# EAGLE schematic Control_Unit (EAGLE 6.5.0)
Control Unit
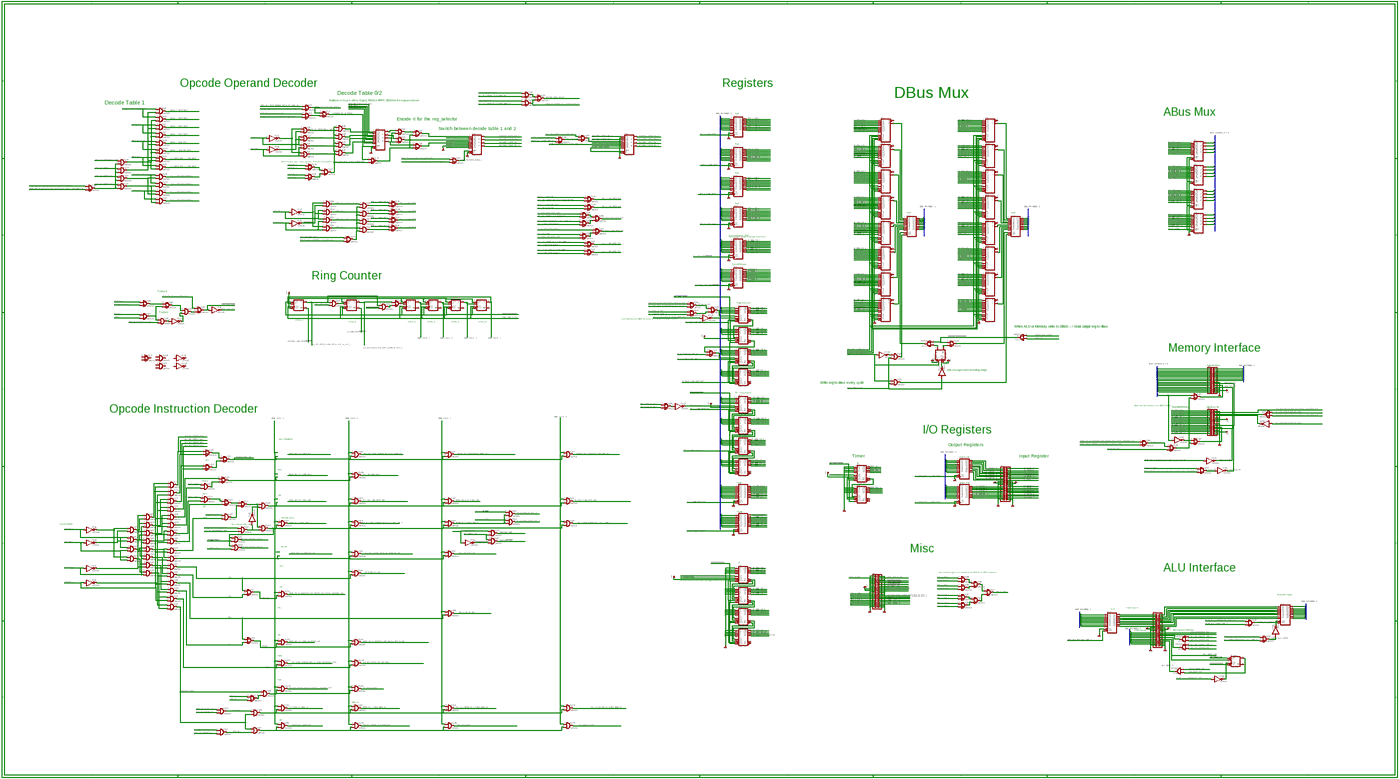
[diagram p0: schematic, sheet 1, overview]
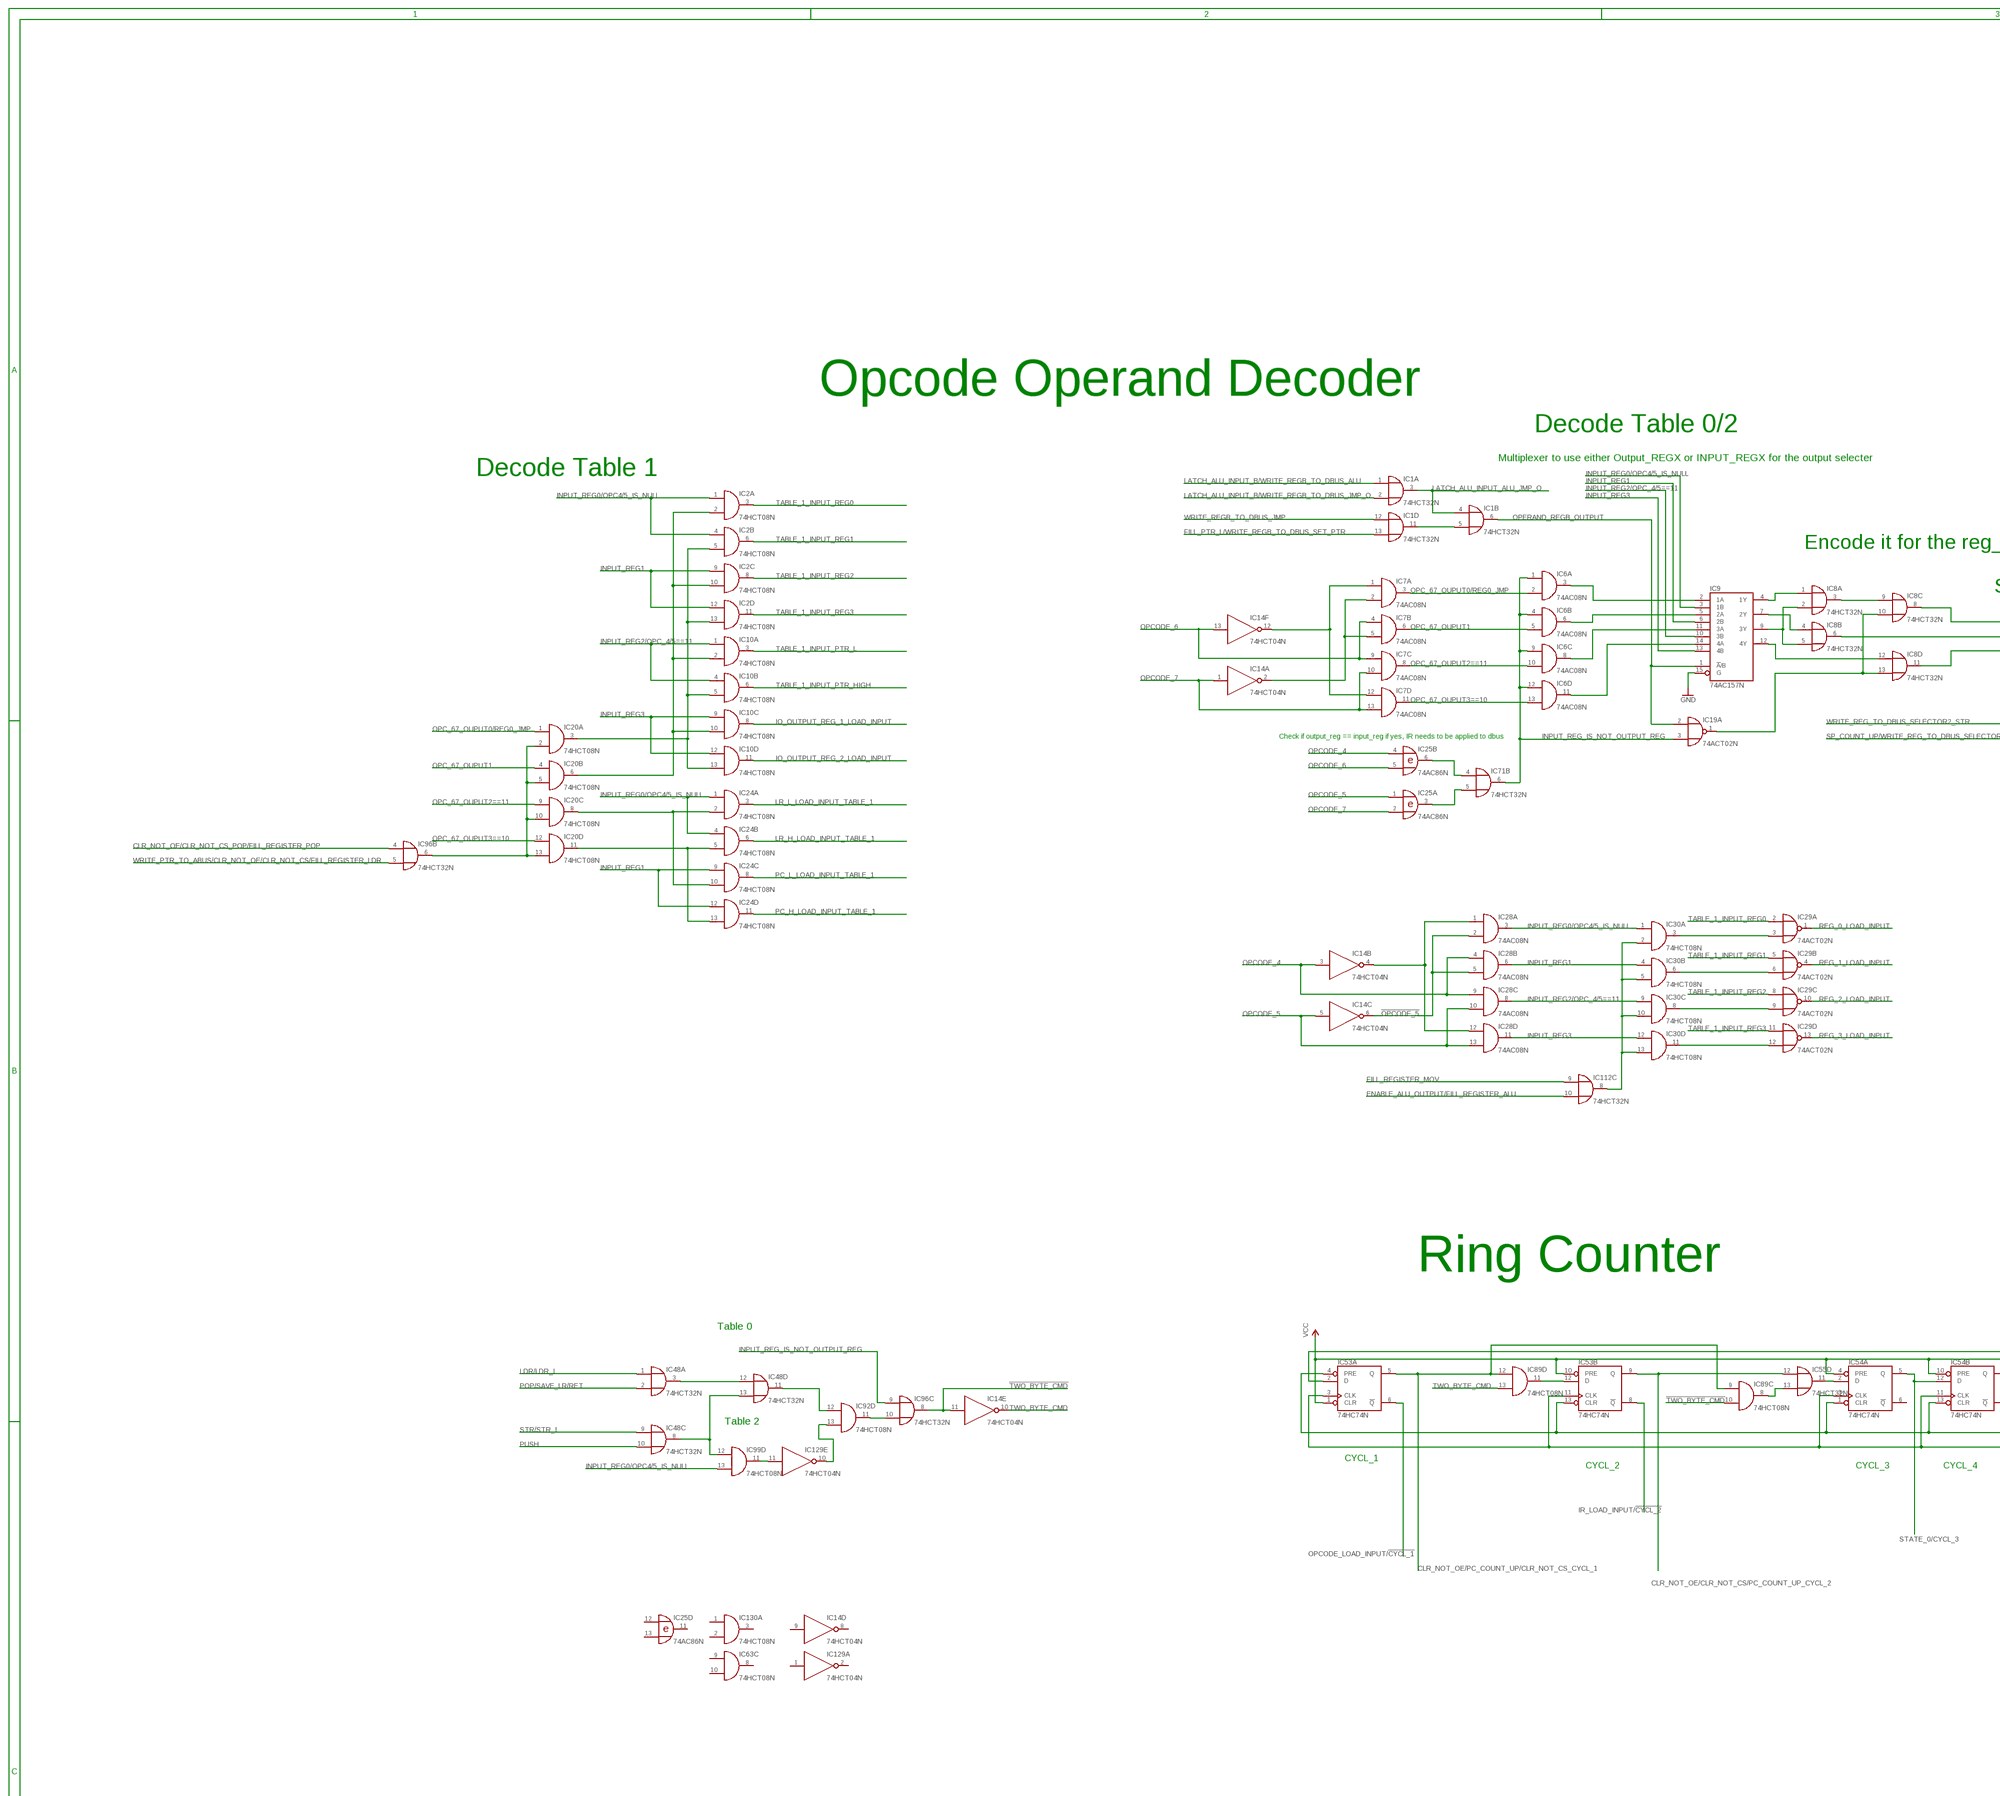
[diagram p1: schematic, sheet 1, part 1 of 8]
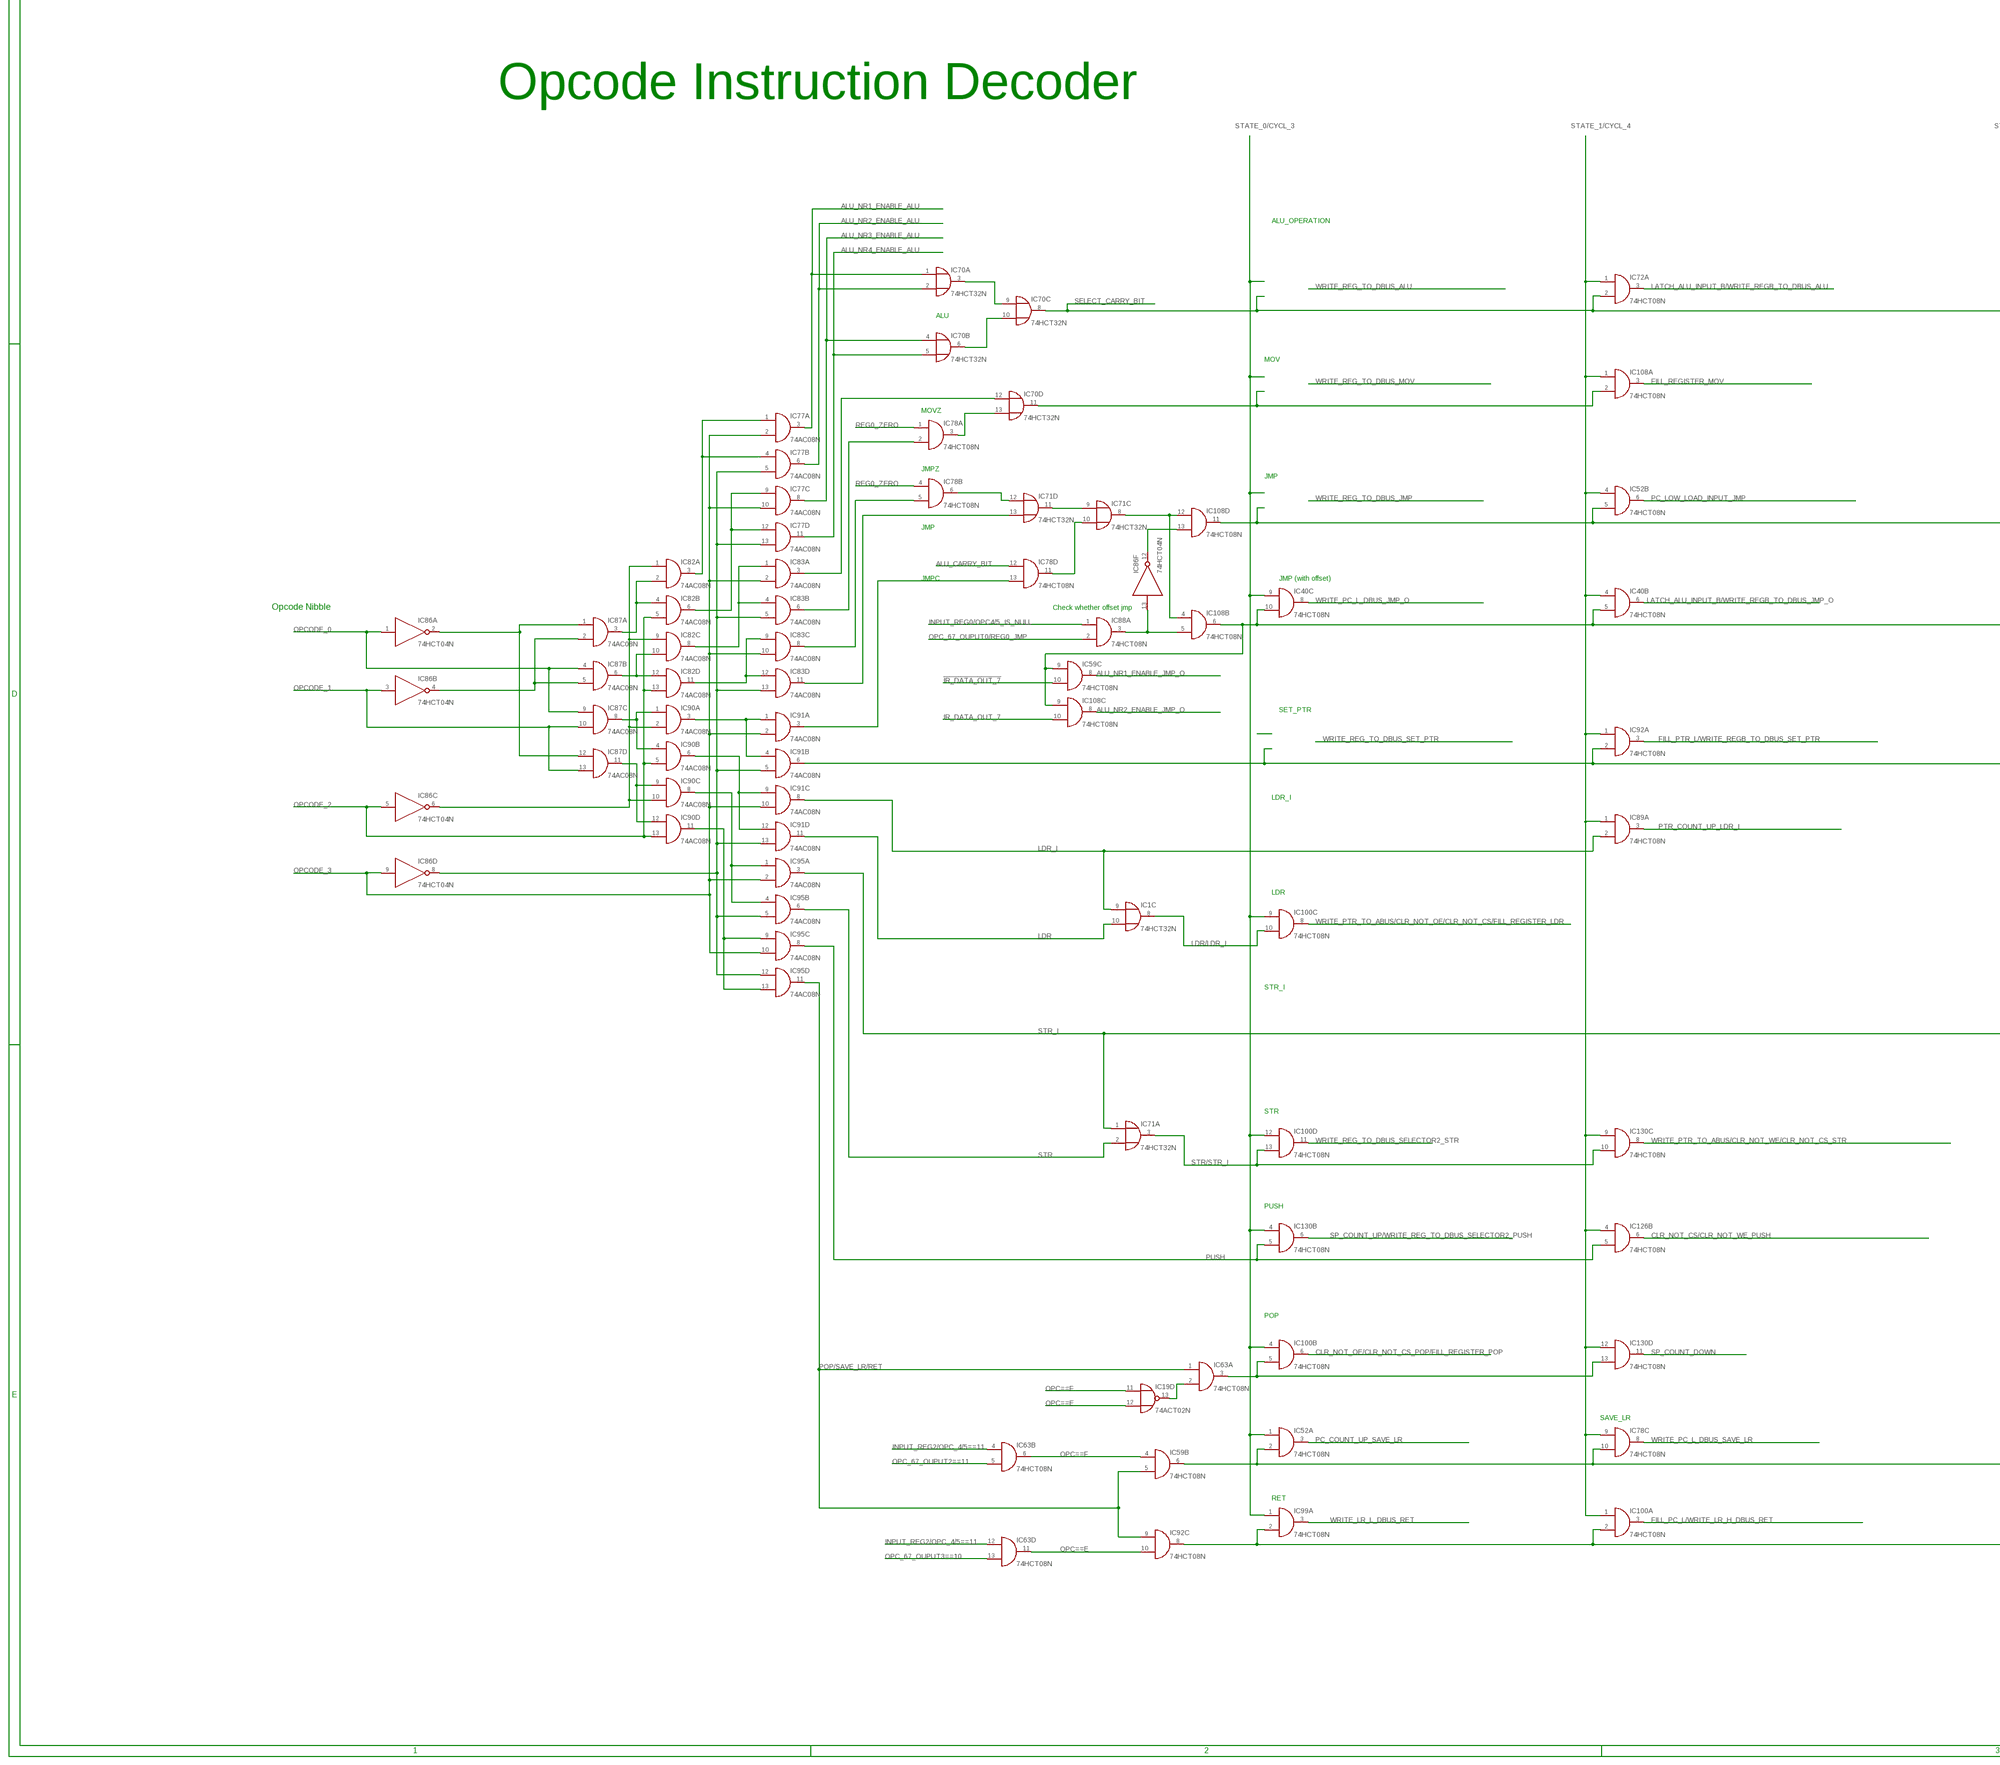
[diagram p2: schematic, sheet 1, part 2 of 8]
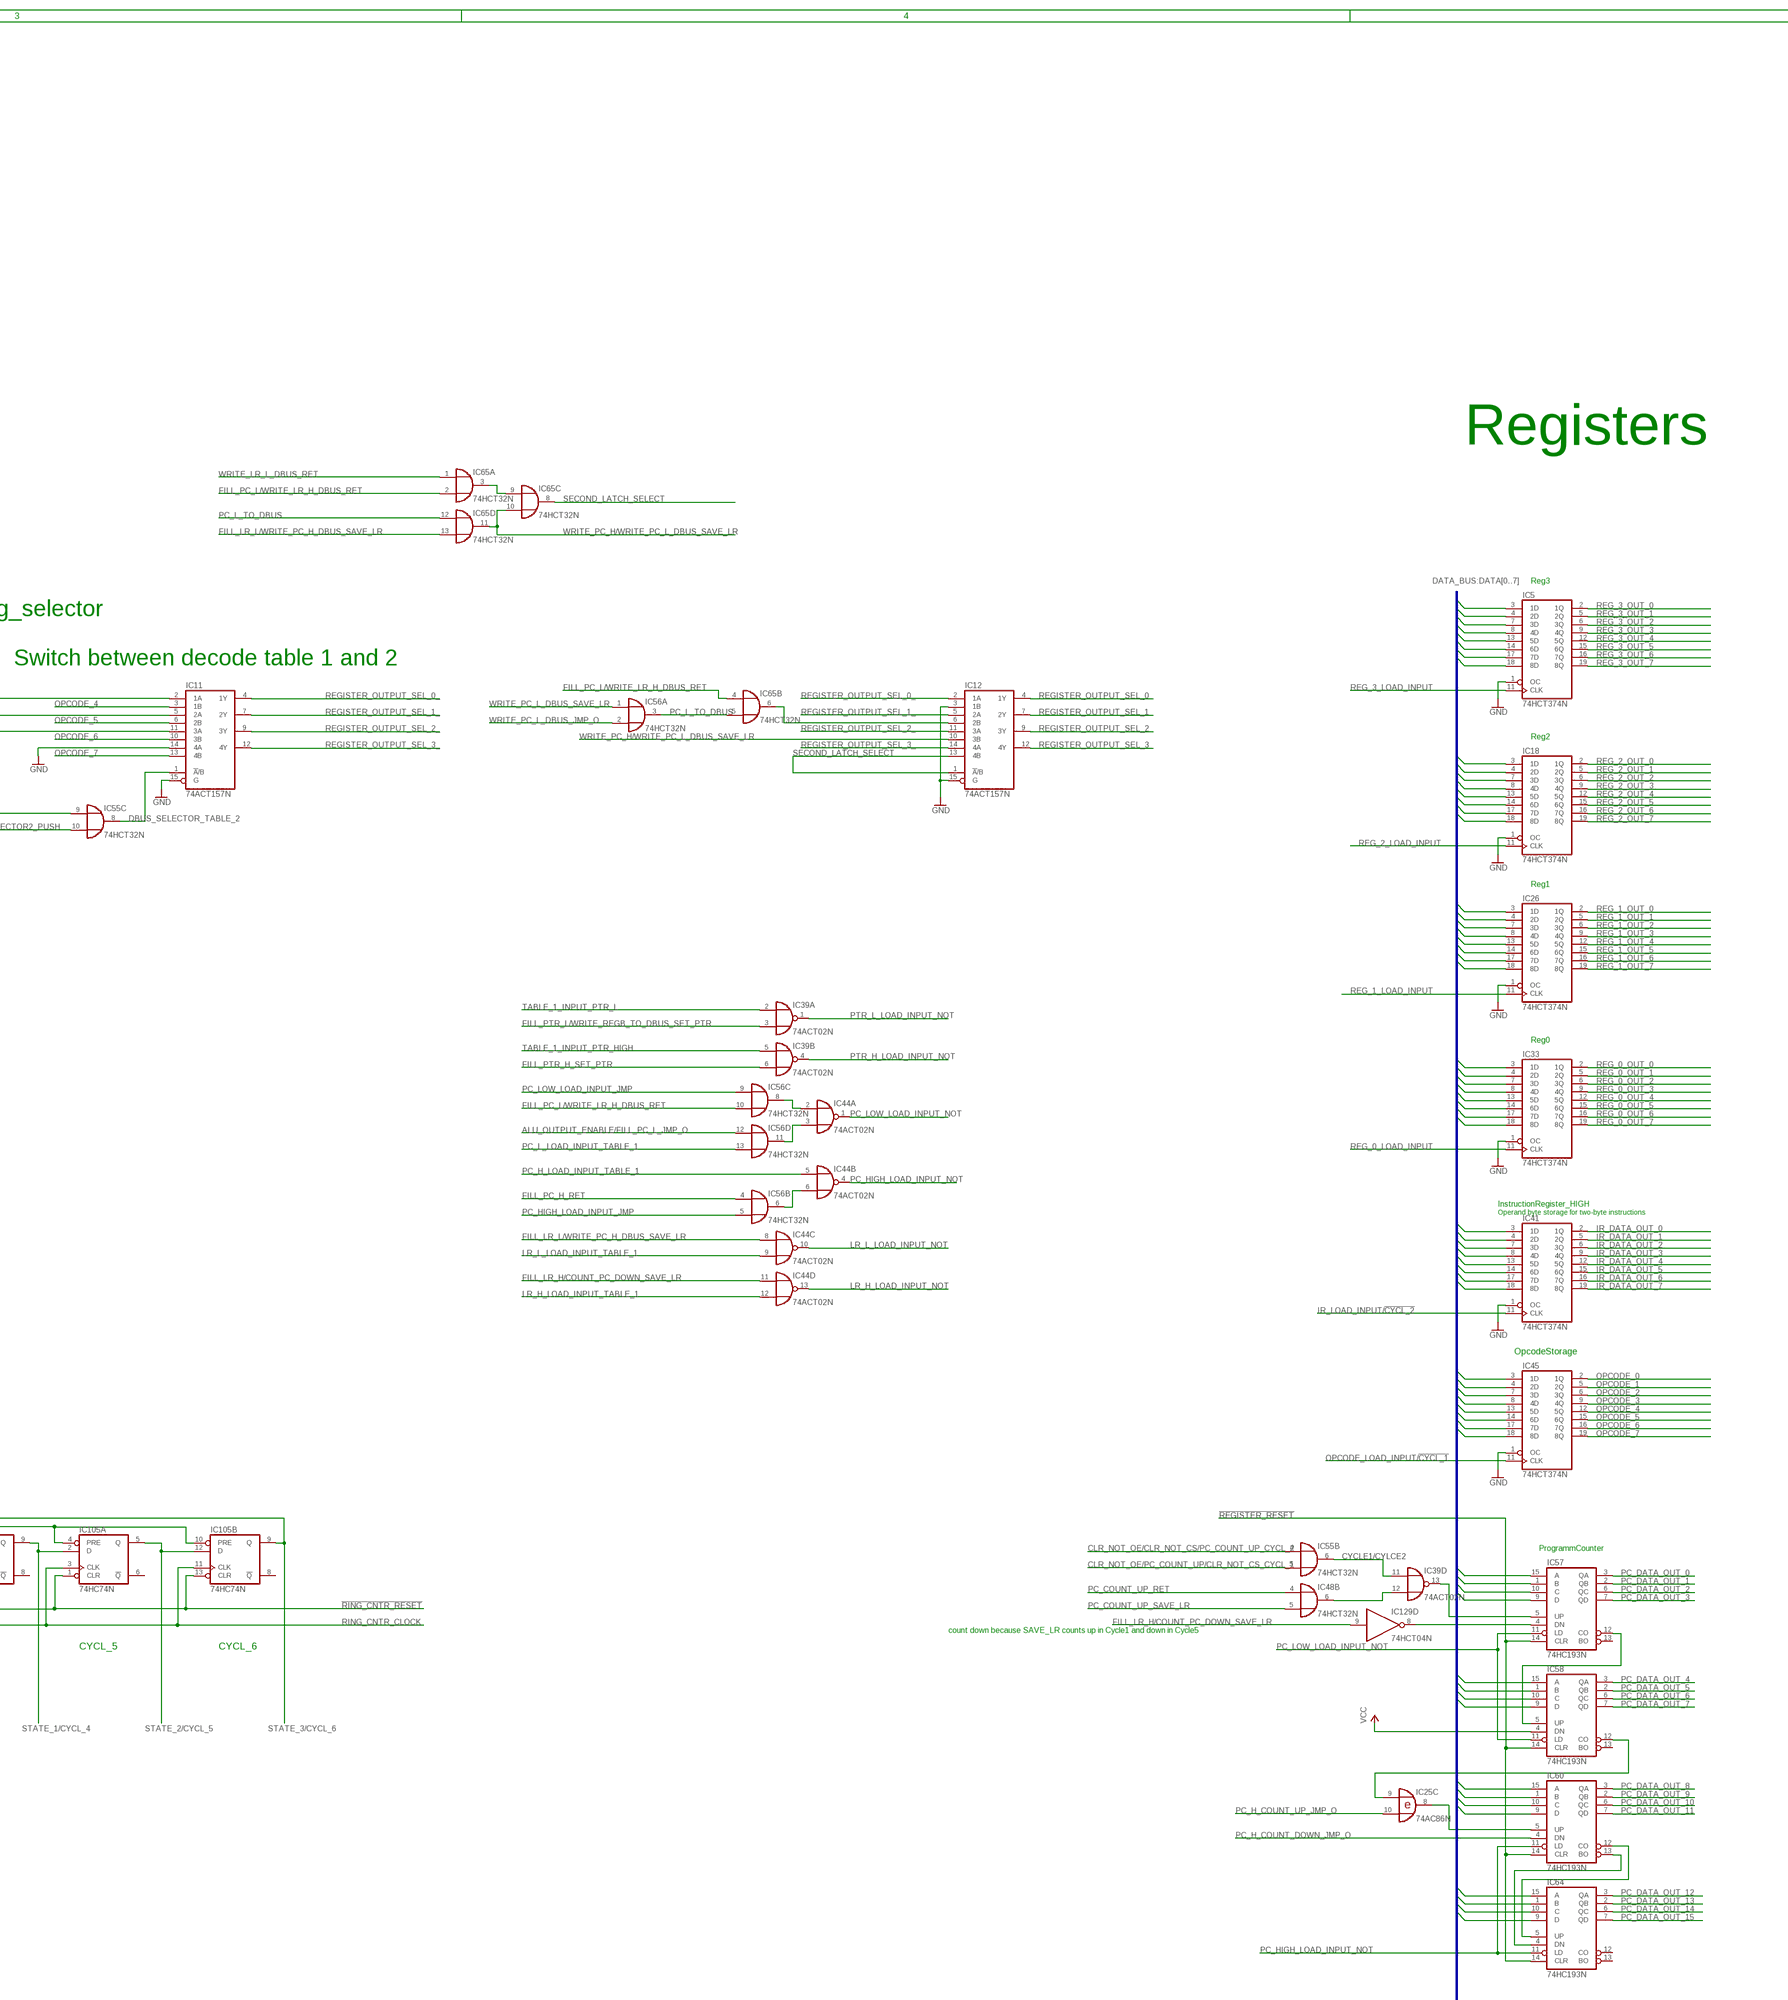
[diagram p3: schematic, sheet 1, part 3 of 8]
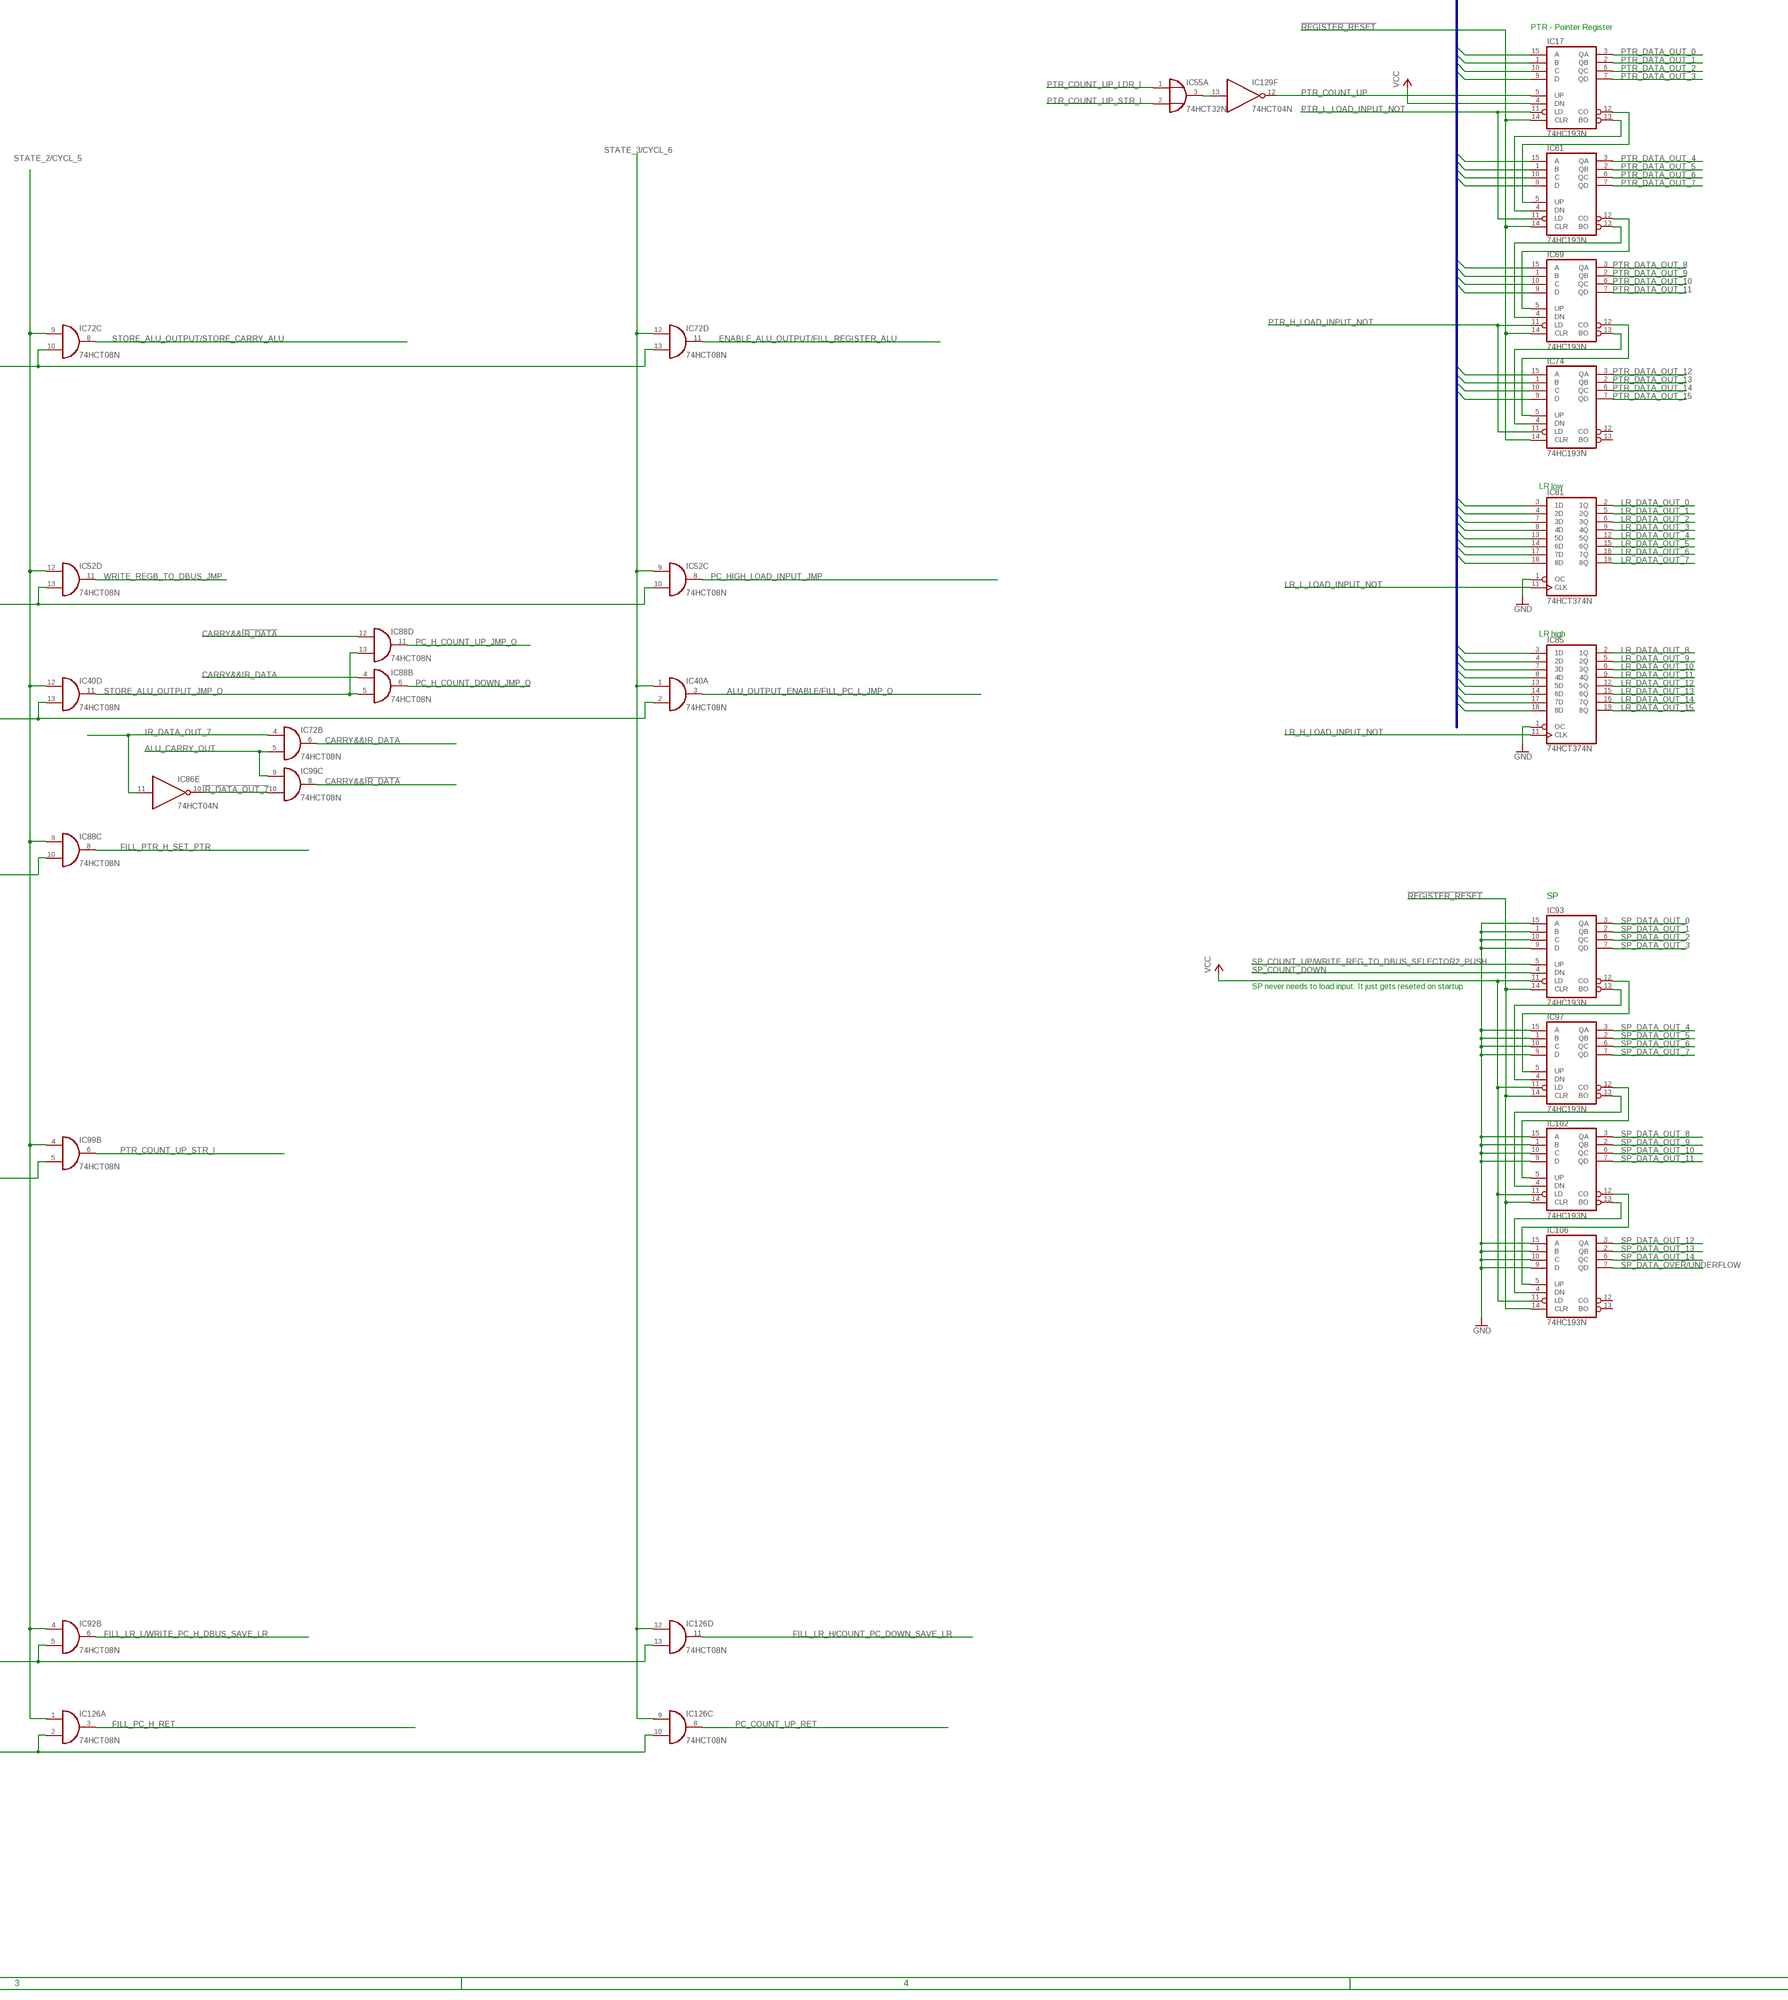
[diagram p4: schematic, sheet 1, part 4 of 8]
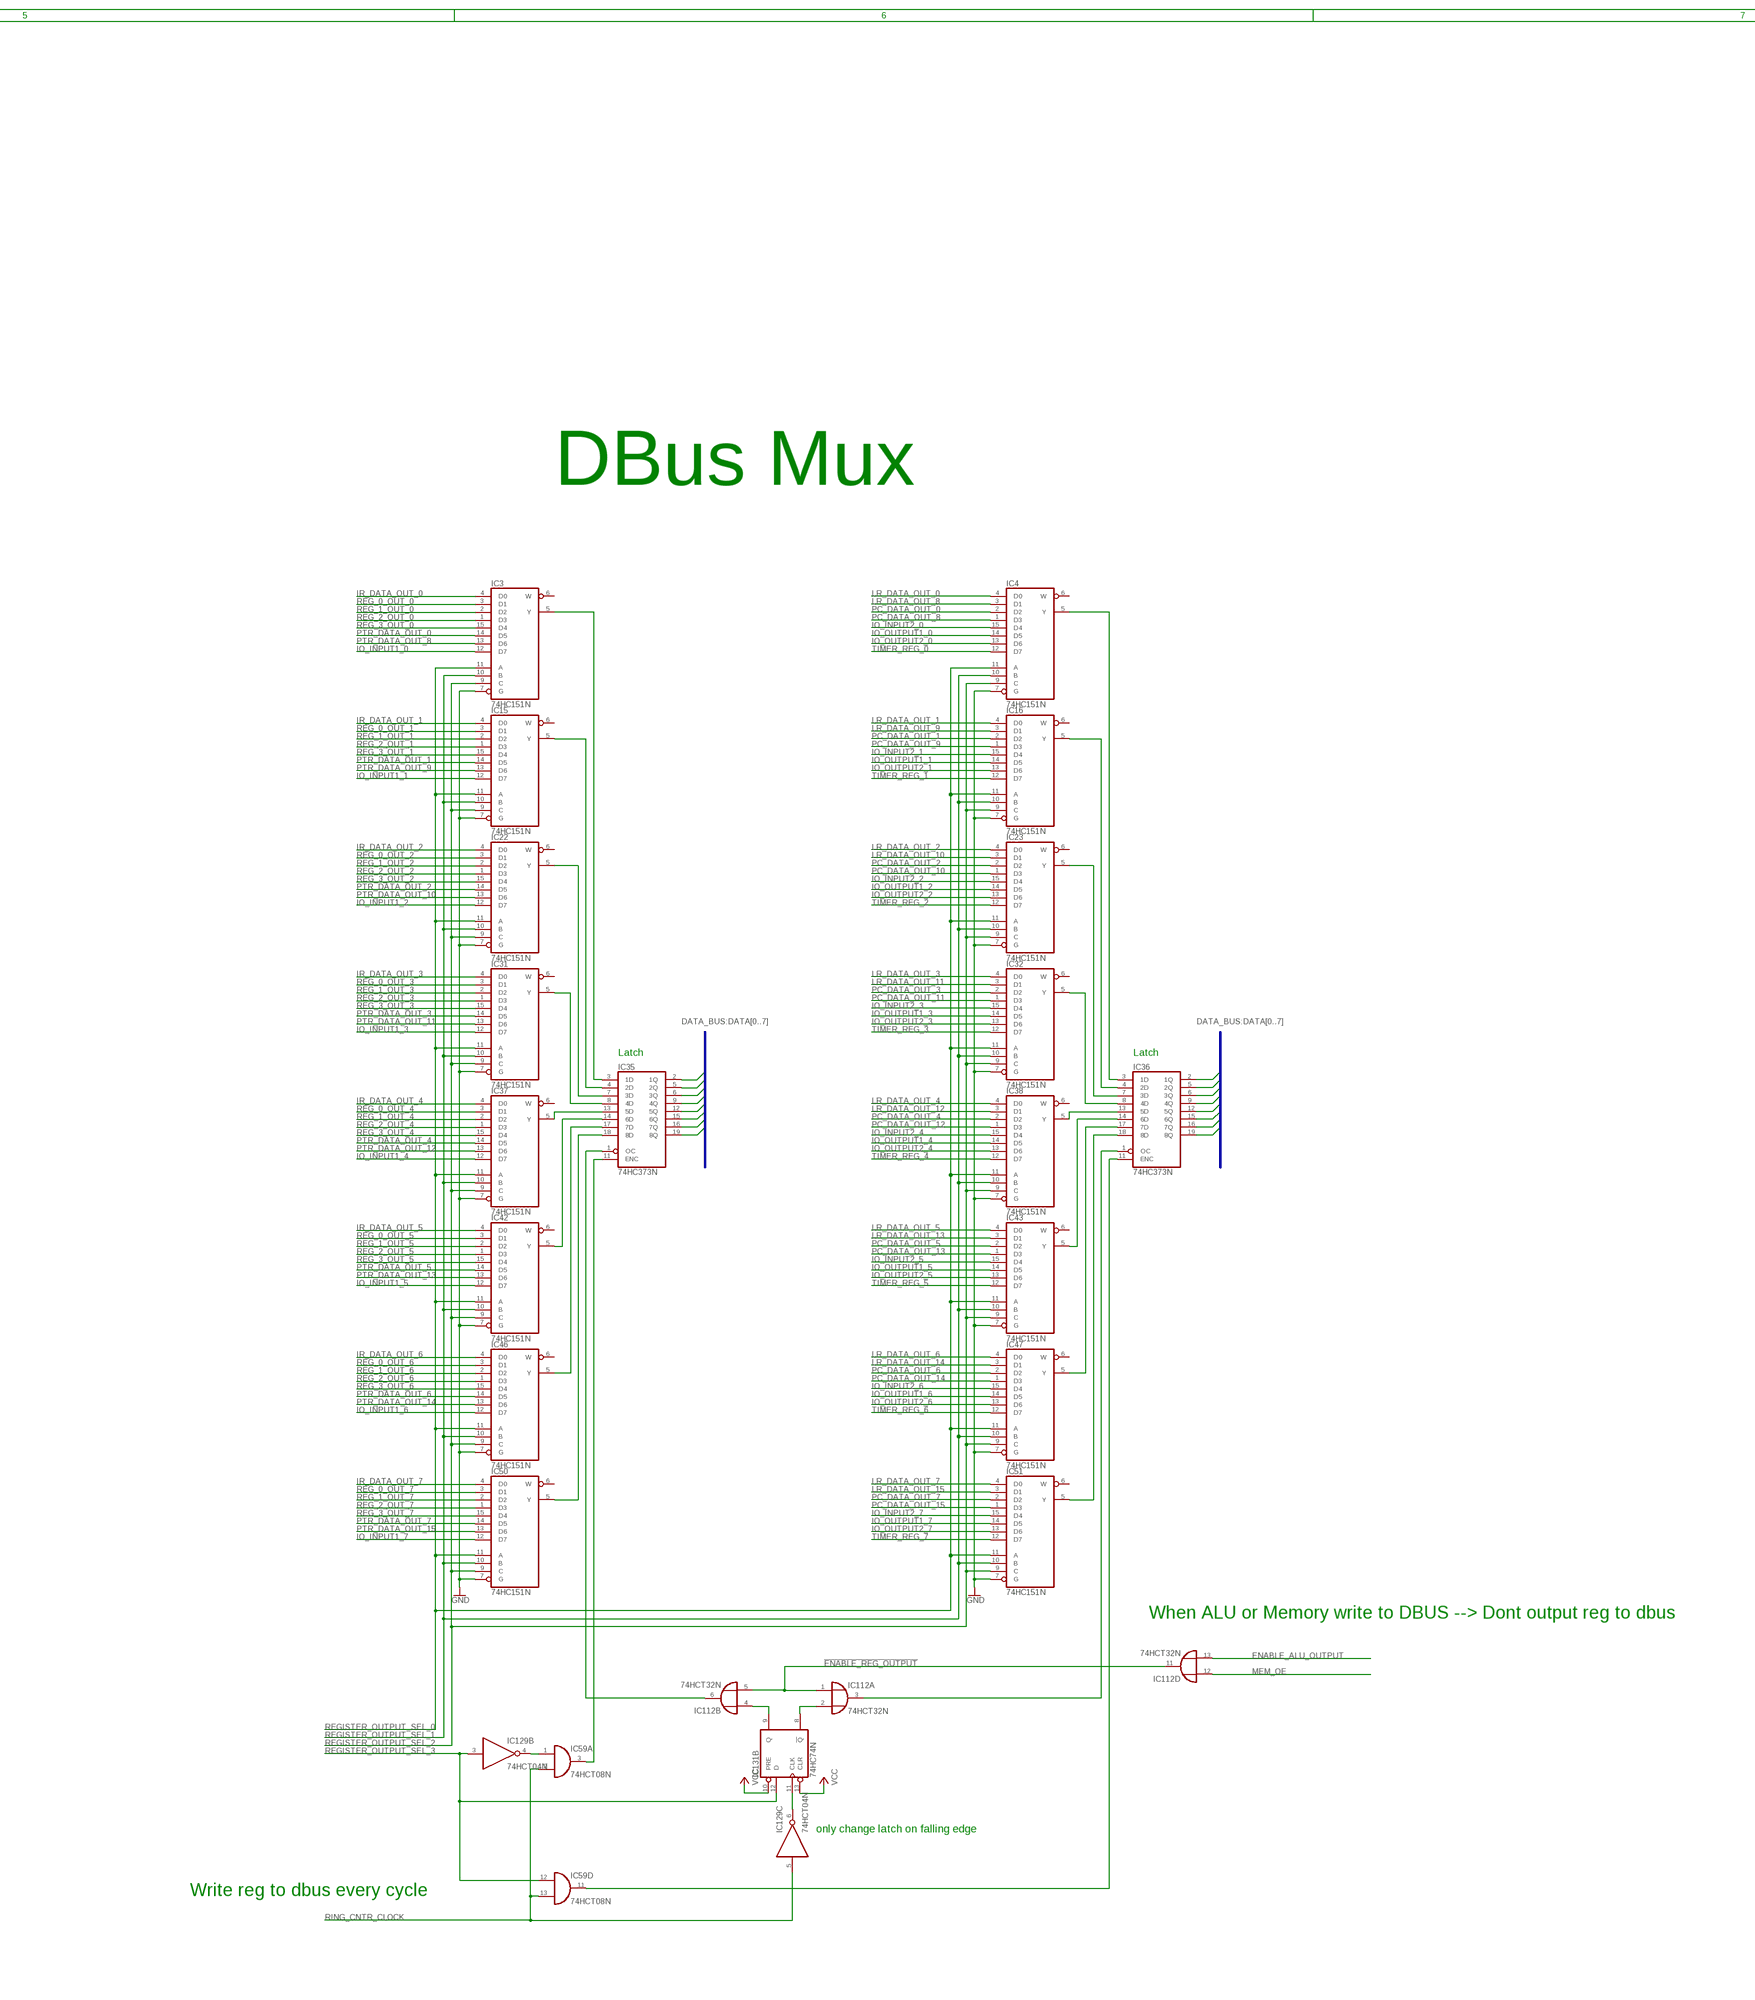
[diagram p5: schematic, sheet 1, part 5 of 8]
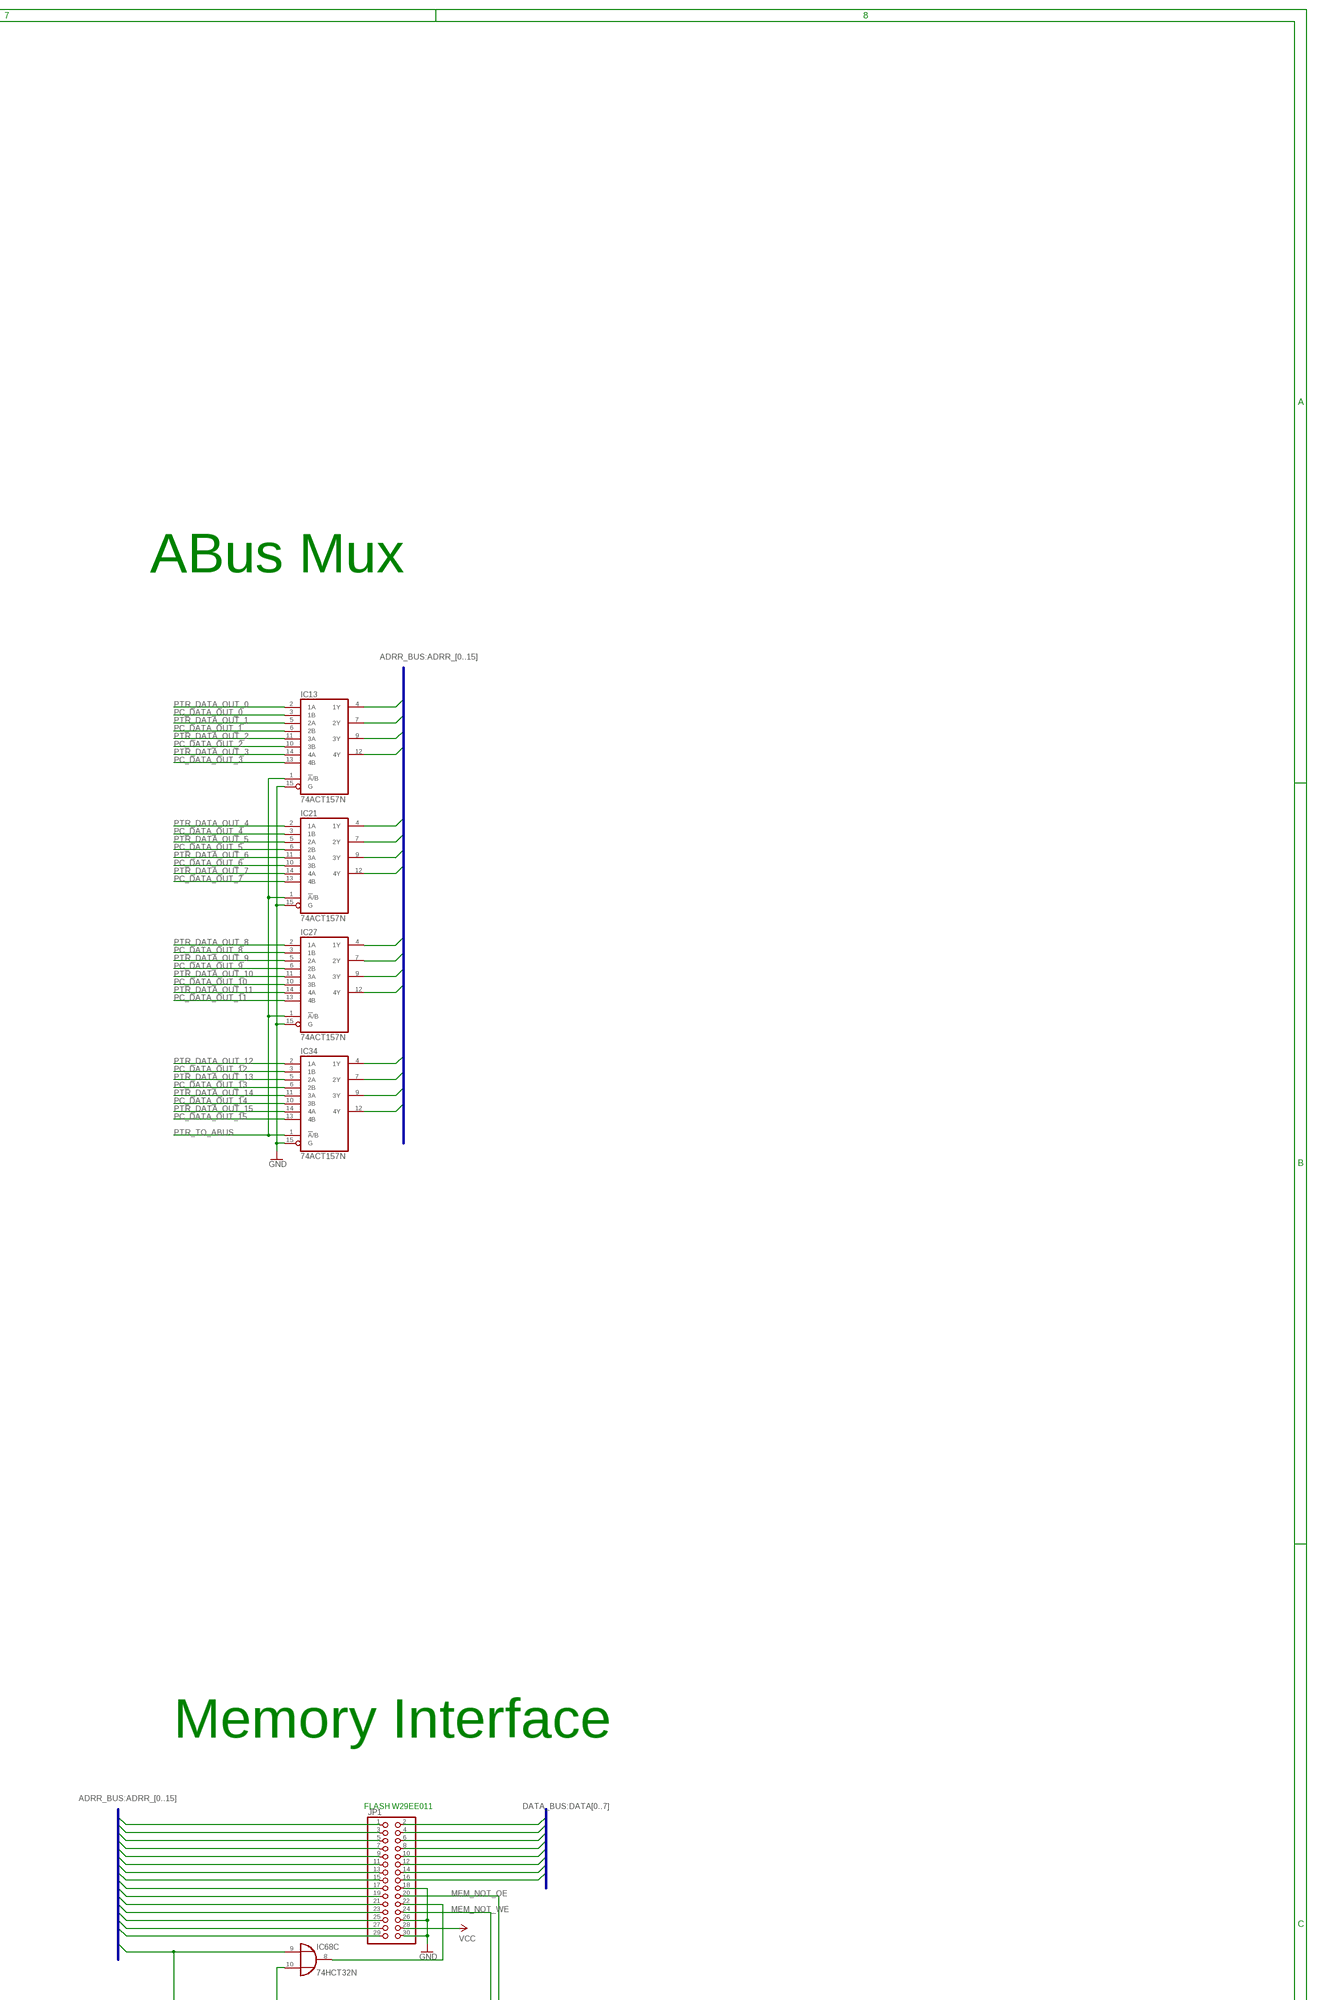
[diagram p6: schematic, sheet 1, part 6 of 8]
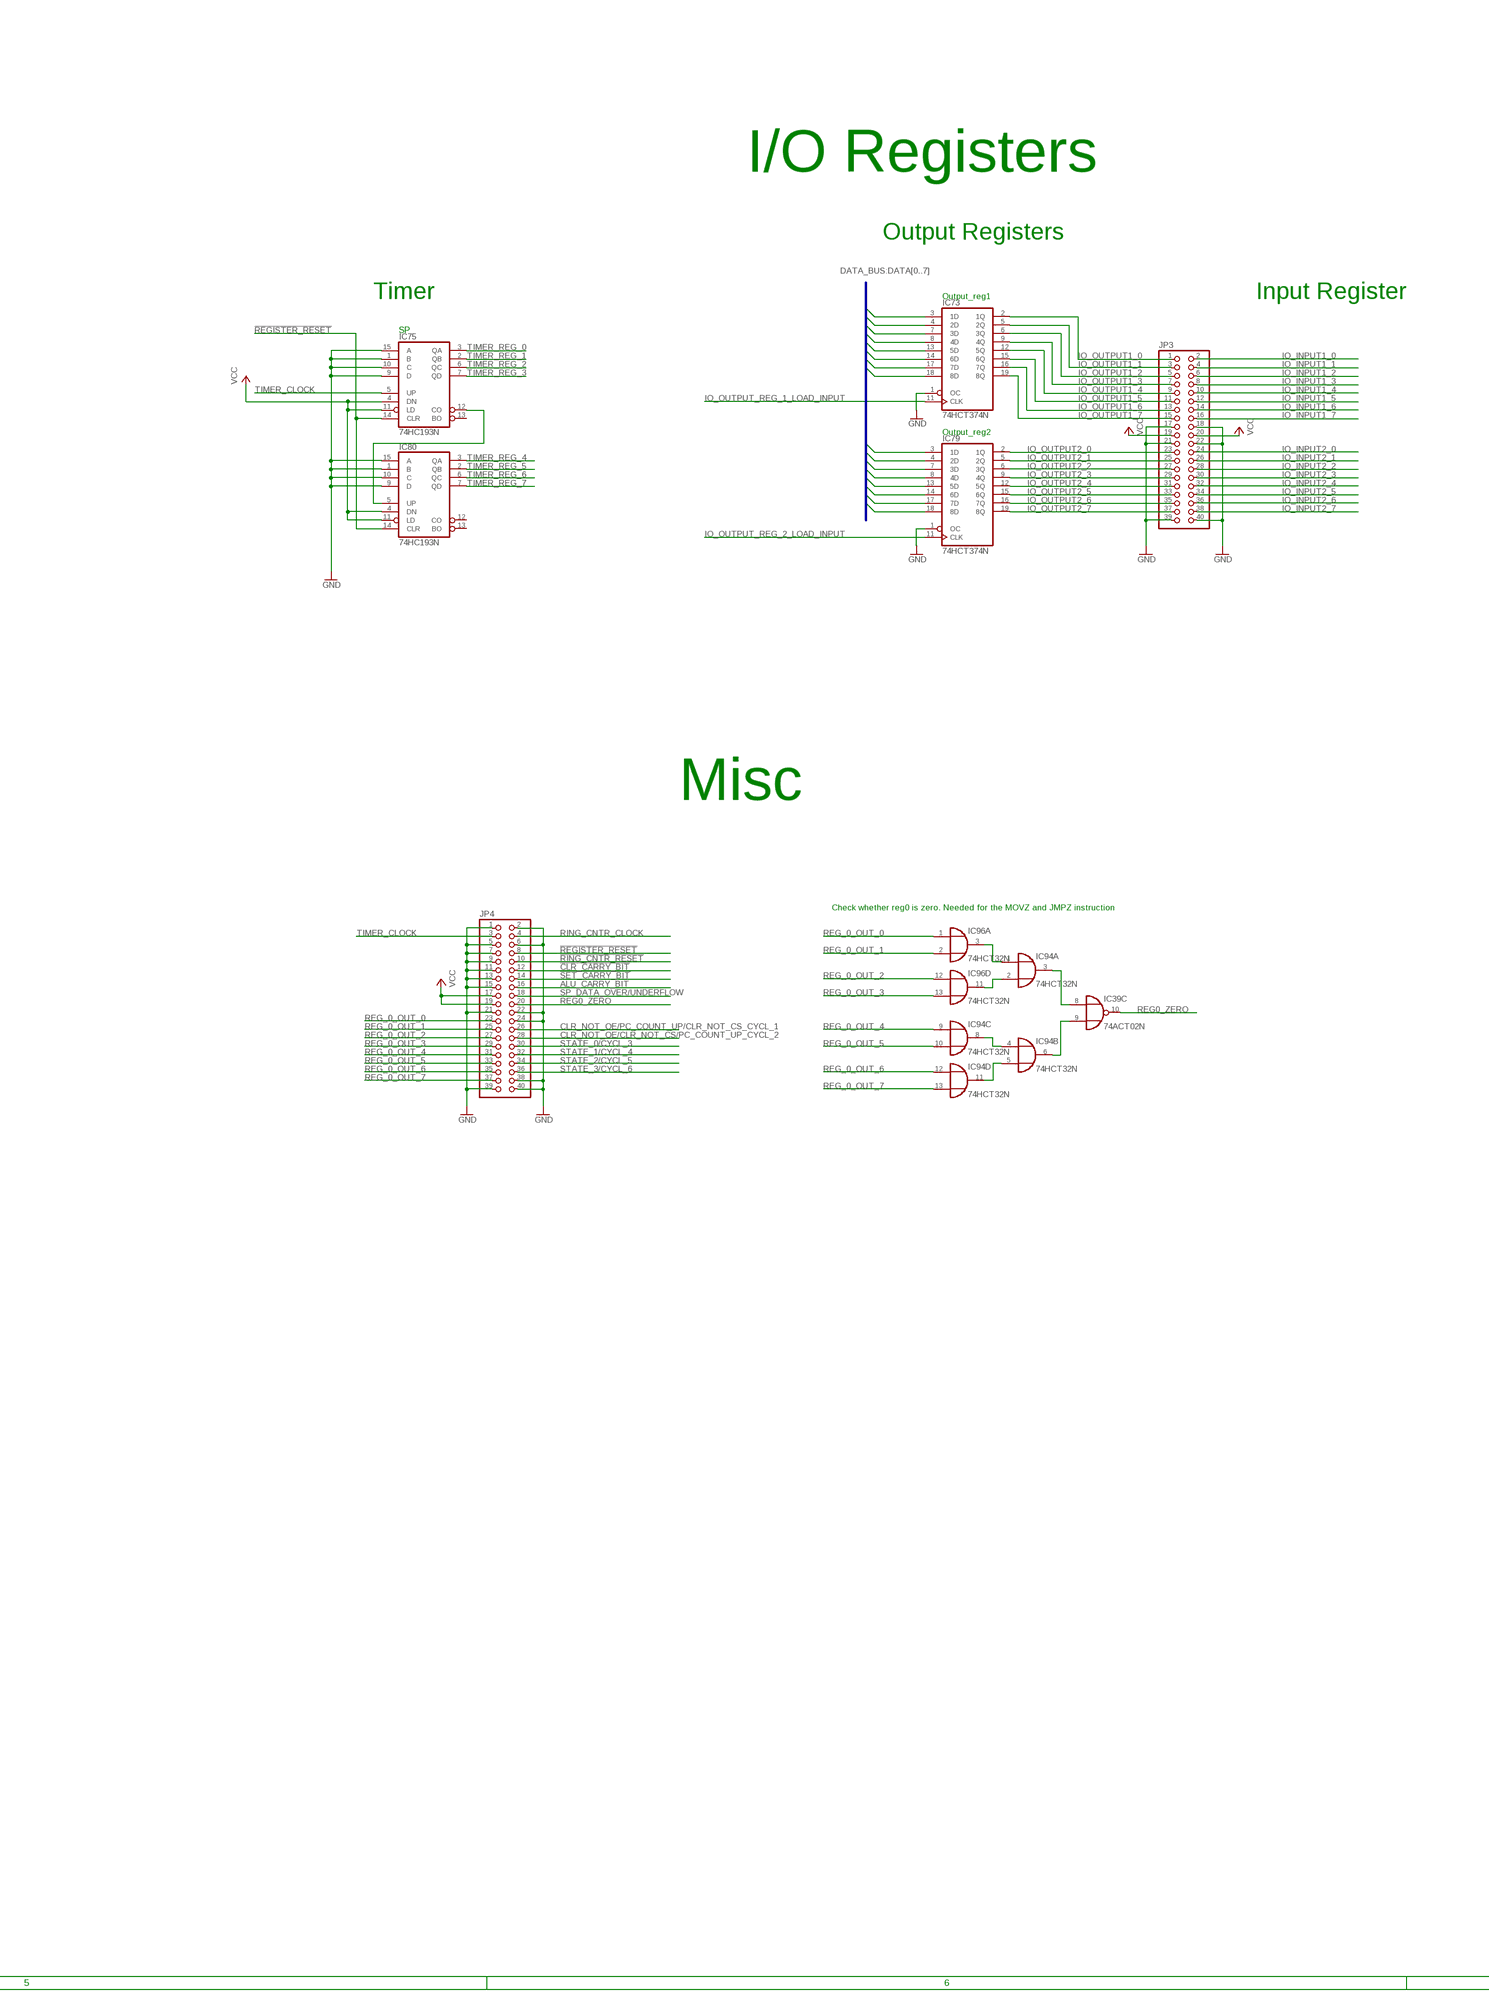
[diagram p7: schematic, sheet 1, part 7 of 8]
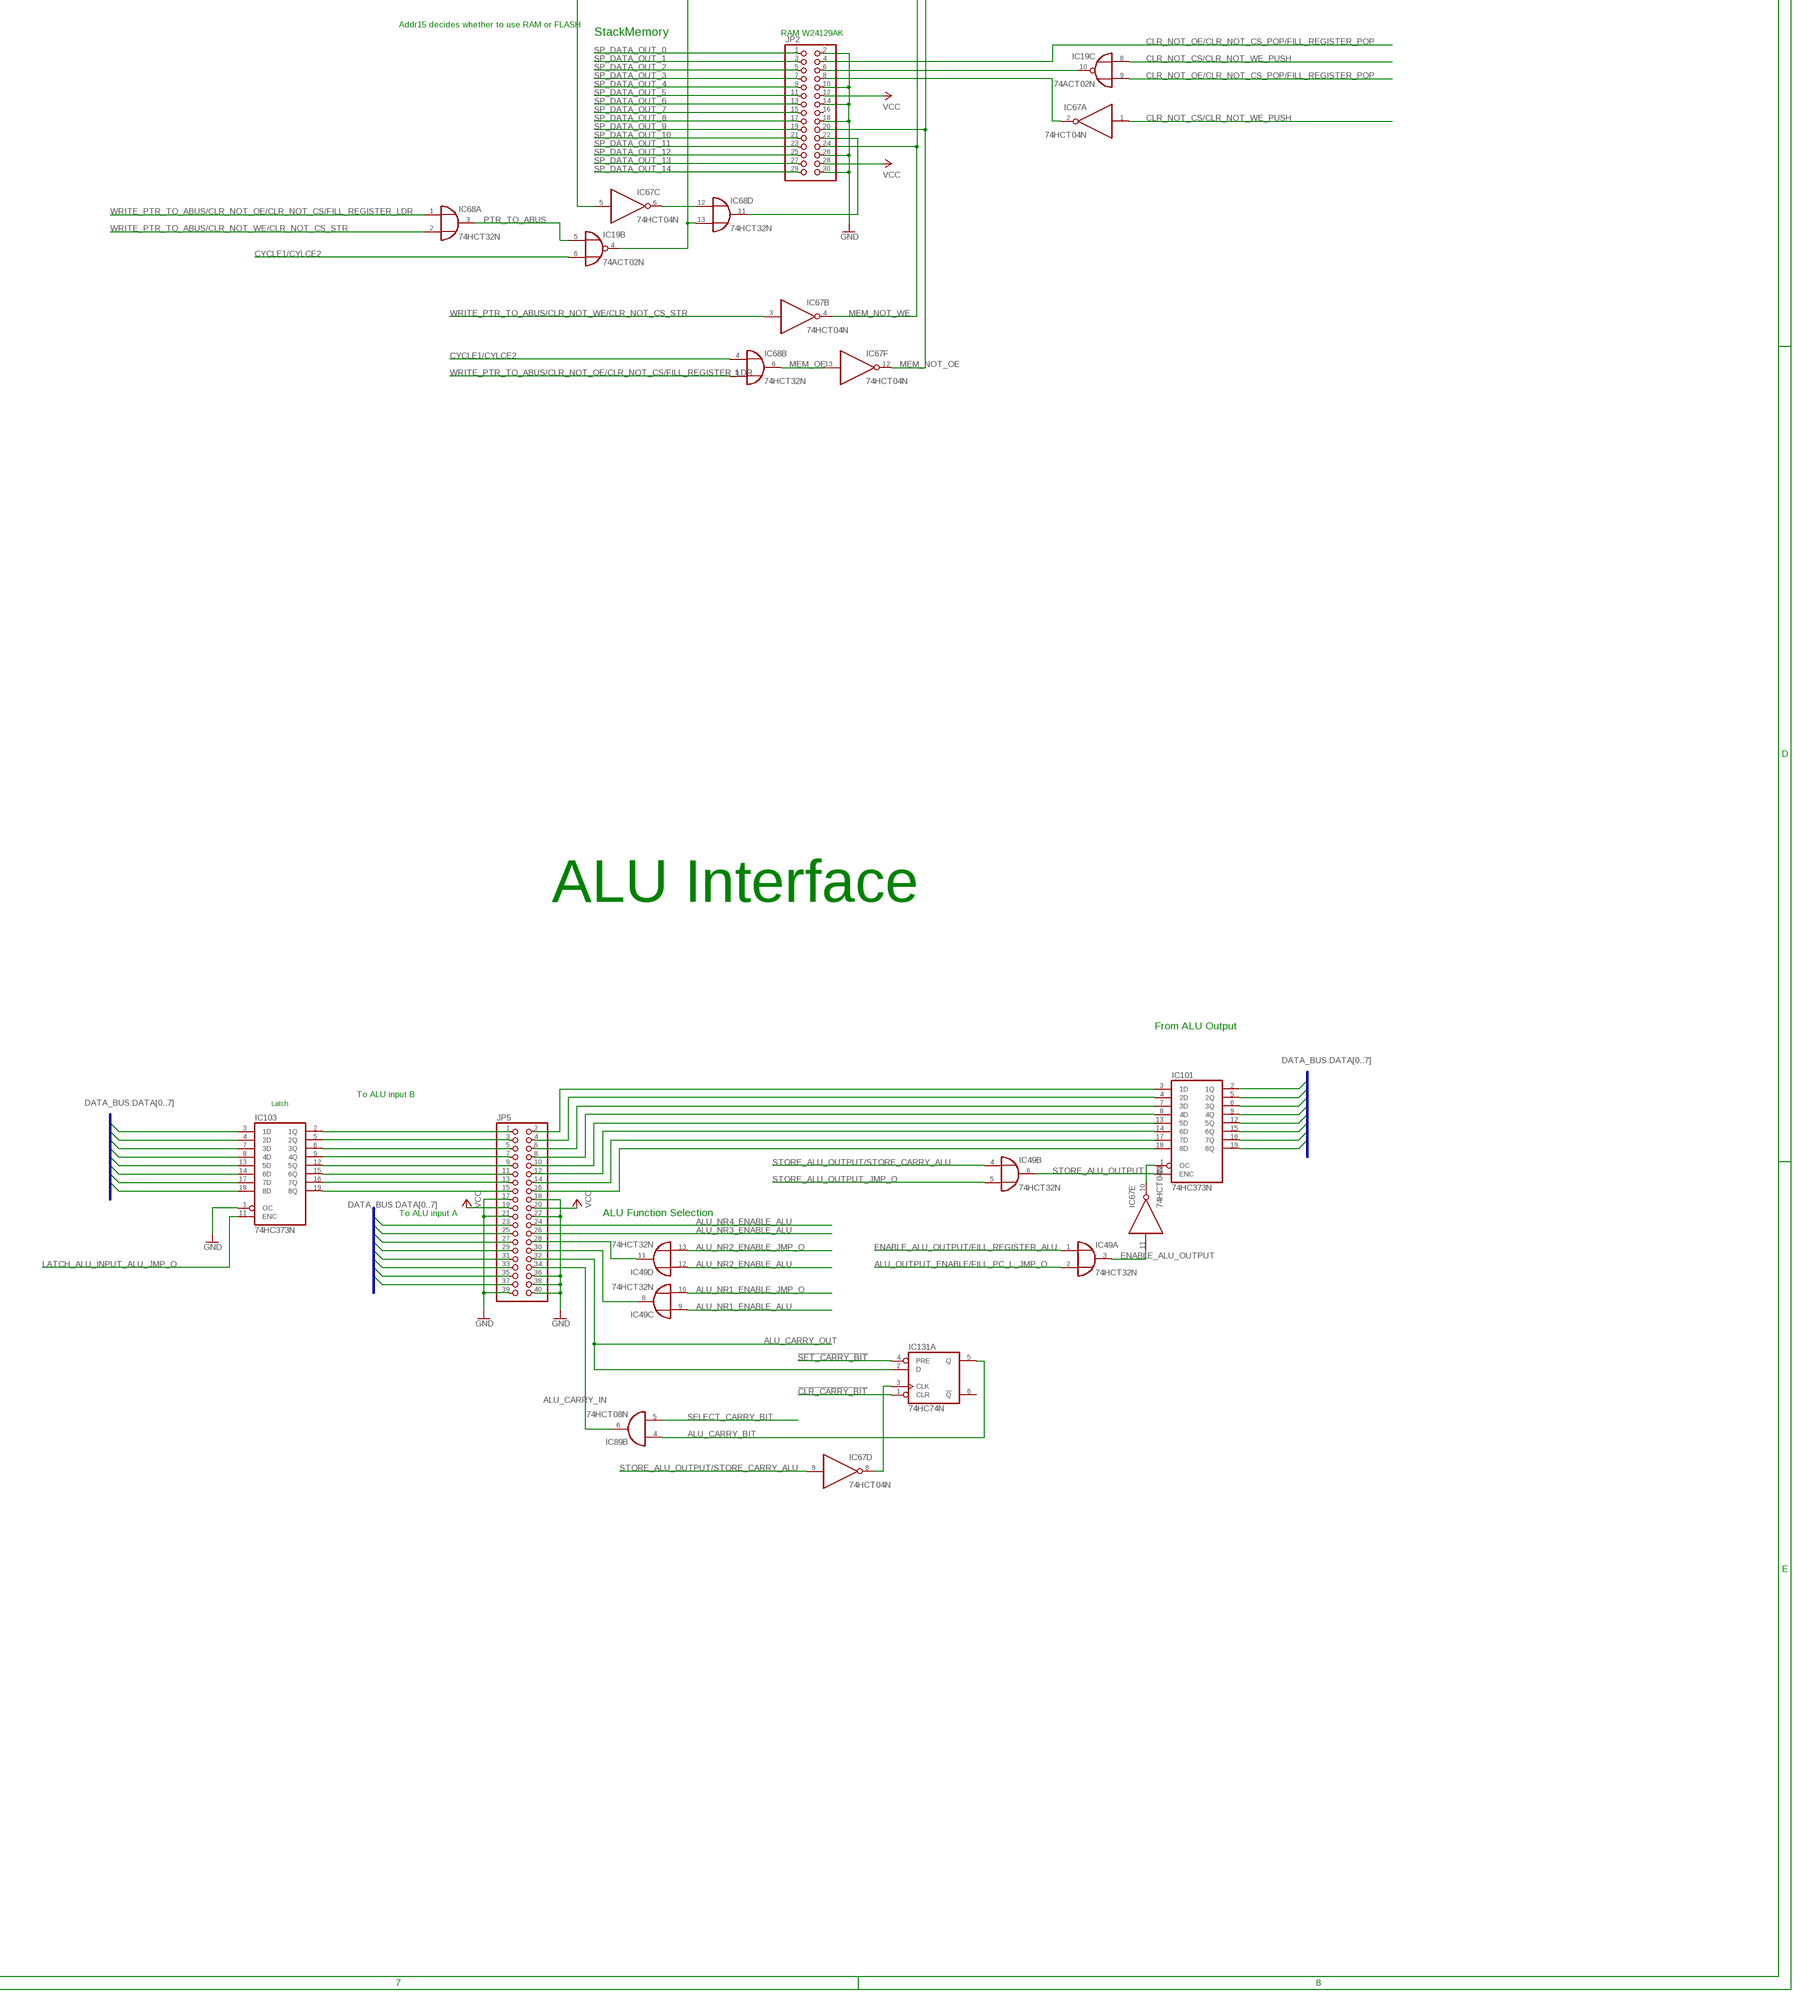
[diagram p8: schematic, sheet 1, part 8 of 8]

## Parts
IC1  74HCT32N  [DIL14]
IC2  74HCT08N  [DIL14]
IC3  74HC151N  [DIL16]
IC4  74HC151N  [DIL16]
IC5  74HCT374N  [DIL20]
IC6  74AC08N  [DIL14]
IC7  74AC08N  [DIL14]
IC8  74HCT32N  [DIL14]
IC9  74AC157N  [DIL16]
IC10  74HCT08N  [DIL14]
IC11  74ACT157N  [DIL16]
IC12  74ACT157N  [DIL16]
IC13  74ACT157N  [DIL16]
IC14  74HCT04N  [DIL14]
IC15  74HC151N  [DIL16]
IC16  74HC151N  [DIL16]
IC17  74HC193N  [DIL16]
IC18  74HCT374N  [DIL20]
IC19  74ACT02N  [DIL14]
IC20  74HCT08N  [DIL14]
IC21  74ACT157N  [DIL16]
IC22  74HC151N  [DIL16]
IC23  74HC151N  [DIL16]
IC24  74HCT08N  [DIL14]
IC25  74AC86N  [DIL14]
IC26  74HCT374N  [DIL20]
IC27  74ACT157N  [DIL16]
IC28  74AC08N  [DIL14]
IC29  74ACT02N  [DIL14]
IC30  74HCT08N  [DIL14]
IC31  74HC151N  [DIL16]
IC32  74HC151N  [DIL16]
IC33  74HCT374N  [DIL20]
IC34  74ACT157N  [DIL16]
IC35  74HC373N  [DIL20]
IC36  74HC373N  [DIL20]
IC37  74HC151N  [DIL16]
IC38  74HC151N  [DIL16]
IC39  74ACT02N  [DIL14]
IC40  74HCT08N  [DIL14]
IC41  74HCT374N  [DIL20]
IC42  74HC151N  [DIL16]
IC43  74HC151N  [DIL16]
IC44  74ACT02N  [DIL14]
IC45  74HCT374N  [DIL20]
IC46  74HC151N  [DIL16]
IC47  74HC151N  [DIL16]
IC48  74HCT32N  [DIL14]
IC49  74HCT32N  [DIL14]
IC50  74HC151N  [DIL16]
IC51  74HC151N  [DIL16]
IC52  74HCT08N  [DIL14]
IC53  74HC74N  [DIL14]
IC54  74HC74N  [DIL14]
IC55  74HCT32N  [DIL14]
IC56  74HCT32N  [DIL14]
IC57  74HC193N  [DIL16]
IC58  74HC193N  [DIL16]
IC59  74HCT08N  [DIL14]
IC60  74HC193N  [DIL16]
IC61  74HC193N  [DIL16]
IC63  74HCT08N  [DIL14]
IC64  74HC193N  [DIL16]
IC65  74HCT32N  [DIL14]
IC67  74HCT04N  [DIL14]
IC68  74HCT32N  [DIL14]
IC69  74HC193N  [DIL16]
IC70  74HCT32N  [DIL14]
IC71  74HCT32N  [DIL14]
IC72  74HCT08N  [DIL14]
IC73  74HCT374N  [DIL20]
IC74  74HC193N  [DIL16]
IC75  74HC193N  [DIL16]
IC77  74AC08N  [DIL14]
IC78  74HCT08N  [DIL14]
IC79  74HCT374N  [DIL20]
IC80  74HC193N  [DIL16]
IC81  74HCT374N  [DIL20]
IC82  74AC08N  [DIL14]
IC83  74AC08N  [DIL14]
IC85  74HCT374N  [DIL20]
IC86  74HCT04N  [DIL14]
IC87  74AC08N  [DIL14]
IC88  74HCT08N  [DIL14]
IC89  74HCT08N  [DIL14]
IC90  74AC08N  [DIL14]
IC91  74AC08N  [DIL14]
IC92  74HCT08N  [DIL14]
IC93  74HC193N  [DIL16]
IC94  74HCT32N  [DIL14]
IC95  74AC08N  [DIL14]
IC96  74HCT32N  [DIL14]
IC97  74HC193N  [DIL16]
IC99  74HCT08N  [DIL14]
IC100  74HCT08N  [DIL14]
IC101  74HC373N  [DIL20]
IC102  74HC193N  [DIL16]
IC103  74HC373N  [DIL20]
IC105  74HC74N  [DIL14]
IC106  74HC193N  [DIL16]
IC108  74HCT08N  [DIL14]
IC112  74HCT32N  [DIL14]
IC126  74HCT08N  [DIL14]
IC129  74HCT04N  [DIL14]
IC130  74HCT08N  [DIL14]
IC131  74HC74N  [DIL14]
JP1  PINHD-2X15  [2X15]
JP2  PINHD-2X15  [2X15]
JP3  PINHD-2X20  [2X20]
JP4  PINHD-2X20  [2X20]
JP5  PINHD-2X20  [2X20]

## Nets
!CLR_CARRY_BIT: IC131.1(A:CLR) JP4.12
!ENABLE_REG_OUTPUT: IC112.1(A:I0) IC112.5(B:I1) IC112.11(D:O)
!IR_DATA_OUT_7: IC59.10(C:I1) IC86.10(E:O) IC99.10(C:I1)
!OPCODE_5: IC14.6(C:O) IC28.2(A:I1) IC28.5(B:I1)
!REGISTER_RESET: IC17.14(CLR) IC57.14(CLR) IC58.14(CLR) IC60.14(CLR) IC61.14(CLR) IC64.14(CLR) IC69.14(CLR) IC74.14(CLR) IC75.14(CLR) IC80.14(CLR) IC93.14(CLR) IC97.14(CLR) IC102.14(CLR) IC106.14(CLR) JP4.8
!RING_CNTR_RESET: IC53.4(A:PRE) IC53.13(B:CLR) IC54.1(A:CLR) IC54.13(B:CLR) IC105.1(A:CLR) IC105.13(B:CLR) JP4.10
!SET_CARRY_BIT: IC131.4(A:PRE) JP4.14
!TWO_BYTE_CMD: IC14.11(E:I) IC89.10(C:I1) IC96.8(C:O)
ADRR_0: IC13.4(1Y) JP1.1
ADRR_1: IC13.7(2Y) JP1.3
ADRR_2: IC13.9(3Y) JP1.5
ADRR_3: IC13.12(4Y) JP1.7
ADRR_4: IC21.4(1Y) JP1.9
ADRR_5: IC21.7(2Y) JP1.11
ADRR_6: IC21.9(3Y) JP1.13
ADRR_7: IC21.12(4Y) JP1.15
ADRR_8: IC27.4(1Y) JP1.17
ADRR_9: IC27.7(2Y) JP1.19
ADRR_10: IC27.9(3Y) JP1.21
ADRR_11: IC27.12(4Y) JP1.23
ADRR_12: IC34.4(1Y) JP1.25
ADRR_13: IC34.7(2Y) JP1.27
ADRR_14: IC34.9(3Y) JP1.29
ADRR_15: IC34.12(4Y) IC67.5(C:I) IC68.9(C:I0)
ALU_CARRY_BIT: IC78.12(D:I0) IC89.4(B:I0) IC131.5(A:Q) JP4.16
ALU_CARRY_IN: IC89.6(B:O) JP5.34
ALU_CARRY_OUT: IC72.5(B:I1) IC99.9(C:I0) IC131.2(A:D) JP5.32
ALU_NR1_ENABLE_ALU: IC49.9(C:I0) IC70.1(A:I0) IC77.3(A:O)
ALU_NR1_ENABLE_JMP_O: IC49.10(C:I1) IC59.8(C:O)
ALU_NR2_ENABLE_ALU: IC49.12(D:I0) IC70.2(A:I1) IC77.6(B:O)
ALU_NR2_ENABLE_JMP_O: IC49.13(D:I1) IC108.8(C:O)
ALU_NR3_ENABLE_ALU: IC70.4(B:I0) IC77.8(C:O) JP5.26
ALU_NR4_ENABLE_ALU: IC70.5(B:I1) IC77.11(D:O) JP5.24
ALU_OUTPUT_ENABLE/FILL_PC_L_JMP_O: IC40.3(A:O) IC49.2(A:I1) IC56.12(D:I0)
CARRY&&!IR_DATA: IC88.12(D:I0) IC99.8(C:O)
CARRY&&IR_DATA: IC72.6(B:O) IC88.4(B:I0)
CLR_NOT_CS/CLR_NOT_WE_PUSH: IC19.8(C:I0) IC67.1(A:I) IC126.6(B:O)
CLR_NOT_OE/CLR_NOT_CS/PC_COUNT_UP_CYCL_2: IC53.9(B:Q) IC55.4(B:I0) IC55.12(D:I0) JP4.28
CLR_NOT_OE/CLR_NOT_CS_POP/FILL_REGISTER_POP: IC19.9(C:I1) IC96.4(B:I0) IC100.6(B:O) JP2.4
CLR_NOT_OE/PC_COUNT_UP/CLR_NOT_CS_CYCL_1: IC53.5(A:Q) IC55.5(B:I1) IC89.9(C:I0) IC89.12(D:I0) JP4.26
CYCLE1/CYLCE2: IC19.6(B:I1) IC39.11(D:I0) IC55.6(B:O) IC68.4(B:I0)
DATA0: IC5.3(1D) IC17.15(A) IC18.3(1D) IC26.3(1D) IC33.3(1D) IC35.2(1Q) IC36.2(1Q) IC41.3(1D) IC45.3(1D) IC57.15(A) IC60.15(A) IC69.15(A) IC73.3(1D) IC79.3(1D) IC81.3(1D) IC85.3(1D) IC101.2(1Q) IC103.3(1D) JP1.2 JP5.23
DATA1: IC5.4(2D) IC17.1(B) IC18.4(2D) IC26.4(2D) IC33.4(2D) IC35.5(2Q) IC36.5(2Q) IC41.4(2D) IC45.4(2D) IC57.1(B) IC60.1(B) IC69.1(B) IC73.4(2D) IC79.4(2D) IC81.4(2D) IC85.4(2D) IC101.5(2Q) IC103.4(2D) JP1.4 JP5.25
DATA2: IC5.7(3D) IC17.10(C) IC18.7(3D) IC26.7(3D) IC33.7(3D) IC35.6(3Q) IC36.6(3Q) IC41.7(3D) IC45.7(3D) IC57.10(C) IC60.10(C) IC69.10(C) IC73.7(3D) IC79.7(3D) IC81.7(3D) IC85.7(3D) IC101.6(3Q) IC103.7(3D) JP1.6 JP5.27
DATA3: IC5.8(4D) IC17.9(D) IC18.8(4D) IC26.8(4D) IC33.8(4D) IC35.9(4Q) IC36.9(4Q) IC41.8(4D) IC45.8(4D) IC57.9(D) IC60.9(D) IC69.9(D) IC73.8(4D) IC79.8(4D) IC81.8(4D) IC85.8(4D) IC101.9(4Q) IC103.8(4D) JP1.8 JP5.29
DATA4: IC5.13(5D) IC18.13(5D) IC26.13(5D) IC33.13(5D) IC35.12(5Q) IC36.12(5Q) IC41.13(5D) IC45.13(5D) IC58.15(A) IC61.15(A) IC64.15(A) IC73.13(5D) IC74.15(A) IC79.13(5D) IC81.13(5D) IC85.13(5D) IC101.12(5Q) IC103.13(5D) JP1.10 JP5.31
DATA5: IC5.14(6D) IC18.14(6D) IC26.14(6D) IC33.14(6D) IC35.15(6Q) IC36.15(6Q) IC41.14(6D) IC45.14(6D) IC58.1(B) IC61.1(B) IC64.1(B) IC73.14(6D) IC74.1(B) IC79.14(6D) IC81.14(6D) IC85.14(6D) IC101.15(6Q) IC103.14(6D) JP1.12 JP5.33
DATA6: IC5.17(7D) IC18.17(7D) IC26.17(7D) IC33.17(7D) IC35.16(7Q) IC36.16(7Q) IC41.17(7D) IC45.17(7D) IC58.10(C) IC61.10(C) IC64.10(C) IC73.17(7D) IC74.10(C) IC79.17(7D) IC81.17(7D) IC85.17(7D) IC101.16(7Q) IC103.17(7D) JP1.14 JP5.35
DATA7: IC5.18(8D) IC18.18(8D) IC26.18(8D) IC33.18(8D) IC35.19(8Q) IC36.19(8Q) IC41.18(8D) IC45.18(8D) IC58.9(D) IC61.9(D) IC64.9(D) IC73.18(8D) IC74.9(D) IC79.18(8D) IC81.18(8D) IC85.18(8D) IC101.19(8Q) IC103.18(8D) JP1.16 JP5.37
DATA_BUS_ENABLE_LATCH: IC35.11(ENC) IC59.3(A:O)
DBUS_SELECTOR_TABLE_2: IC11.1(!A!/B) IC55.8(C:O)
ENABLE_ALU_OUTPUT: IC49.3(A:O) IC67.11(E:I) IC112.13(D:I1)
ENABLE_ALU_OUTPUT/FILL_REGISTER_ALU: IC49.1(A:I0) IC72.11(D:O) IC112.10(C:I1)
FDSGDFGFDSGFSDGFDGSDG: IC8.10(C:I1) IC8.13(D:I1) IC19.1(A:O)
FILL_LR_H/COUNT_PC_DOWN_SAVE_LR: IC44.11(D:I0) IC126.11(D:O) IC129.9(D:I)
FILL_LR_L/WRITE_PC_H_DBUS_SAVE_LR: IC44.8(C:I0) IC65.13(D:I1) IC92.6(B:O)
FILL_PC_H_RET: IC56.4(B:I0) IC126.3(A:O)
FILL_PC_L/WRITE_LR_H_DBUS_RET: IC56.10(C:I1) IC65.2(A:I1) IC65.4(B:I0) IC100.3(A:O)
FILL_PTR_H_SET_PTR: IC39.6(B:I1) IC88.8(C:O)
FILL_PTR_L/WRITE_REGB_TO_DBUS_SET_PTR: IC1.13(D:I1) IC39.3(A:I1) IC92.3(A:O)
FILL_REGISTER_MOV: IC108.3(A:O) IC112.9(C:I0)
FSDFAFSDFSFDDDDDDDDDDDDDDDDDDDDDDDDDDDDDDDD1: IC2.2(A:I1) IC2.10(C:I1) IC10.2(A:I1) IC10.10(C:I1) IC20.6(B:O)
GND: IC3.7(G) IC4.7(G) IC5.1(OC) IC9.15(G) IC11.14(4A) IC11.15(G) IC12.3(1B) IC12.15(G) IC13.15(G) IC15.7(G) IC16.7(G) IC18.1(OC) IC21.15(G) IC22.7(G) IC23.7(G) IC26.1(OC) IC27.15(G) IC31.7(G) IC32.7(G) IC33.1(OC) IC34.15(G) IC37.7(G) IC38.7(G) IC41.1(OC) IC42.7(G) IC43.7(G) IC45.1(OC) IC46.7(G) IC47.7(G) IC50.7(G) IC51.7(G) IC73.1(OC) IC75.1(B) IC75.9(D) IC75.10(C) IC75.15(A) IC79.1(OC) IC80.1(B) IC80.9(D) IC80.10(C) IC80.15(A) IC81.1(OC) IC85.1(OC) IC93.1(B) IC93.9(D) IC93.10(C) IC93.15(A) IC97.1(B) IC97.9(D) IC97.10(C) IC97.15(A) IC102.1(B) IC102.9(D) IC102.10(C) IC102.15(A) IC103.1(OC) IC106.1(B) IC106.9(D) IC106.10(C) IC106.15(A) JP1.18 JP1.26 JP1.30 JP2.2 JP2.10 JP2.14 JP2.18 JP2.26 JP2.30 JP3.17 JP3.18 JP3.21 JP3.22 JP3.39 JP3.40 JP4.1 JP4.2 JP4.5 JP4.6 JP4.7 JP4.9 JP4.11 JP4.13 JP4.15 JP4.21 JP4.22 JP4.24 JP4.38 JP4.39 JP4.40 JP5.17 JP5.18 JP5.21 JP5.22 JP5.36 JP5.38 JP5.39 JP5.40
INPUT_REG0/OPC4/5_IS_NULL: IC2.1(A:I0) IC2.4(B:I0) IC9.3(1B) IC24.1(A:I0) IC24.4(B:I0) IC28.3(A:O) IC30.1(A:I0) IC88.1(A:I0) IC99.13(D:I1)
INPUT_REG1: IC2.9(C:I0) IC2.12(D:I0) IC9.6(2B) IC24.9(C:I0) IC24.12(D:I0) IC28.6(B:O) IC30.4(B:I0)
INPUT_REG2/OPC_4/5==11: IC9.10(3B) IC10.1(A:I0) IC10.4(B:I0) IC28.8(C:O) IC30.9(C:I0) IC63.4(B:I0) IC63.12(D:I0)
INPUT_REG3: IC9.13(4B) IC10.9(C:I0) IC10.12(D:I0) IC28.11(D:O) IC30.12(D:I0)
INPUT_REG_IS_NOT_OUTPUT_REG: IC6.1(A:I0) IC6.4(B:I0) IC6.9(C:I0) IC6.12(D:I0) IC19.3(A:I1) IC71.6(B:O) IC96.9(C:I0)
IO_INPUT1_0: IC3.12(D7) JP3.2
IO_INPUT1_1: IC15.12(D7) JP3.4
IO_INPUT1_2: IC22.12(D7) JP3.6
IO_INPUT1_3: IC31.12(D7) JP3.8
IO_INPUT1_4: IC37.12(D7) JP3.10
IO_INPUT1_5: IC42.12(D7) JP3.12
IO_INPUT1_6: IC46.12(D7) JP3.14
IO_INPUT1_7: IC50.12(D7) JP3.16
IO_INPUT2_0: IC4.15(D4) JP3.24
IO_INPUT2_1: IC16.15(D4) JP3.26
IO_INPUT2_2: IC23.15(D4) JP3.28
IO_INPUT2_3: IC32.15(D4) JP3.30
IO_INPUT2_4: IC38.15(D4) JP3.32
IO_INPUT2_5: IC43.15(D4) JP3.34
IO_INPUT2_6: IC47.15(D4) JP3.36
IO_INPUT2_7: IC51.15(D4) JP3.38
IO_OUTPUT1_0: IC4.14(D5) IC73.2(1Q) JP3.1
IO_OUTPUT1_1: IC16.14(D5) IC73.5(2Q) JP3.3
IO_OUTPUT1_2: IC23.14(D5) IC73.6(3Q) JP3.5
IO_OUTPUT1_3: IC32.14(D5) IC73.9(4Q) JP3.7
IO_OUTPUT1_4: IC38.14(D5) IC73.12(5Q) JP3.9
IO_OUTPUT1_5: IC43.14(D5) IC73.15(6Q) JP3.11
IO_OUTPUT1_6: IC47.14(D5) IC73.16(7Q) JP3.13
IO_OUTPUT1_7: IC51.14(D5) IC73.19(8Q) JP3.15
IO_OUTPUT2_0: IC4.13(D6) IC79.2(1Q) JP3.23
IO_OUTPUT2_1: IC16.13(D6) IC79.5(2Q) JP3.25
IO_OUTPUT2_2: IC23.13(D6) IC79.6(3Q) JP3.27
IO_OUTPUT2_3: IC32.13(D6) IC79.9(4Q) JP3.29
IO_OUTPUT2_4: IC38.13(D6) IC79.12(5Q) JP3.31
IO_OUTPUT2_5: IC43.13(D6) IC79.15(6Q) JP3.33
IO_OUTPUT2_6: IC47.13(D6) IC79.16(7Q) JP3.35
IO_OUTPUT2_7: IC51.13(D6) IC79.19(8Q) JP3.37
IO_OUTPUT_REG_1_LOAD_INPUT: IC10.8(C:O) IC73.11(CLK)
IO_OUTPUT_REG_2_LOAD_INPUT: IC10.11(D:O) IC79.11(CLK)
IR_DATA_OUT_0: IC3.4(D0) IC41.2(1Q)
IR_DATA_OUT_1: IC15.4(D0) IC41.5(2Q)
IR_DATA_OUT_2: IC22.4(D0) IC41.6(3Q)
IR_DATA_OUT_3: IC31.4(D0) IC41.9(4Q)
IR_DATA_OUT_4: IC37.4(D0) IC41.12(5Q)
IR_DATA_OUT_5: IC41.15(6Q) IC42.4(D0)
IR_DATA_OUT_6: IC41.16(7Q) IC46.4(D0)
IR_DATA_OUT_7: IC41.19(8Q) IC50.4(D0) IC72.4(B:I0) IC86.11(E:I) IC108.10(C:I1)
IR_LOAD_INPUT/!CYCL_2: IC41.11(CLK) IC53.8(B:!Q)
LATCH_ALU_INPUT_ALU_JMP_O: IC1.3(A:O) IC1.4(B:I0) IC103.11(ENC)
LATCH_ALU_INPUT_B/WRITE_REGB_TO_DBUS_ALU: IC1.1(A:I0) IC72.3(A:O)
LATCH_ALU_INPUT_B/WRITE_REGB_TO_DBUS_JMP_O: IC1.2(A:I1) IC40.6(B:O)
LDR: IC1.10(C:I1) IC91.11(D:O)
LDR/LDR_I: IC1.8(C:O) IC48.1(A:I0) IC100.10(C:I1)
LDR_I: IC1.9(C:I0) IC89.2(A:I1) IC91.8(C:O)
LR_DATA_OUT_0: IC4.4(D0) IC81.2(1Q)
LR_DATA_OUT_1: IC16.4(D0) IC81.5(2Q)
LR_DATA_OUT_2: IC23.4(D0) IC81.6(3Q)
LR_DATA_OUT_3: IC32.4(D0) IC81.9(4Q)
LR_DATA_OUT_4: IC38.4(D0) IC81.12(5Q)
LR_DATA_OUT_5: IC43.4(D0) IC81.15(6Q)
LR_DATA_OUT_6: IC47.4(D0) IC81.16(7Q)
LR_DATA_OUT_7: IC51.4(D0) IC81.19(8Q)
LR_DATA_OUT_8: IC4.3(D1) IC85.2(1Q)
LR_DATA_OUT_9: IC16.3(D1) IC85.5(2Q)
LR_DATA_OUT_10: IC23.3(D1) IC85.6(3Q)
LR_DATA_OUT_11: IC32.3(D1) IC85.9(4Q)
LR_DATA_OUT_12: IC38.3(D1) IC85.12(5Q)
LR_DATA_OUT_13: IC43.3(D1) IC85.15(6Q)
LR_DATA_OUT_14: IC47.3(D1) IC85.16(7Q)
LR_DATA_OUT_15: IC51.3(D1) IC85.19(8Q)
LR_H_LOAD_INPUT_NOT: IC44.13(D:O) IC85.11(CLK)
LR_H_LOAD_INPUT_TABLE_1: IC24.6(B:O) IC44.12(D:I1)
LR_L_LOAD_INPUT_NOT: IC44.10(C:O) IC81.11(CLK)
LR_L_LOAD_INPUT_TABLE_1: IC24.3(A:O) IC44.9(C:I1)
MEM_NOT_CE: IC19.4(B:O) IC68.10(C:I1) IC68.13(D:I1)
MEM_NOT_OE: IC67.12(F:O) JP1.20 JP2.20
MEM_NOT_WE: IC67.4(B:O) JP1.24 JP2.24
MEM_OE: IC67.13(F:I) IC68.6(B:O) IC112.12(D:I0)
N$1: IC3.5(Y) IC35.3(1D)
N$2: IC99.11(D:O) IC129.11(E:I)
N$3: IC15.5(Y) IC35.4(2D)
N$4: IC1.5(B:I1) IC1.11(D:O)
N$5: IC55.13(D:I1) IC89.8(C:O)
N$6: IC30.2(A:I1) IC30.5(B:I1) IC30.10(C:I1) IC30.13(D:I1) IC112.8(C:O)
N$7: IC59.1(A:I0) IC129.4(B:O)
N$8: IC70.13(D:I1) IC78.3(A:O)
N$9: IC29.3(A:I1) IC30.3(A:O)
N$10: IC86.2(A:O) IC87.1(A:I0) IC87.12(D:I0)
N$11: IC55.3(A:O) IC129.13(F:I)
N$12: IC36.11(ENC) IC59.11(D:O)
N$13: IC48.11(D:O) IC92.12(D:I0)
N$14: IC39.12(D:I1) IC48.6(B:O)
N$15: IC52.5(B:I1) IC52.10(C:I1) IC52.13(D:I1) IC108.11(D:O)
N$16: IC86.4(B:O) IC87.2(A:I1) IC87.5(B:I1)
N$17: IC63.3(A:O) IC100.5(B:I1) IC130.13(D:I1)
N$18: IC53.12(B:D) IC89.11(D:O)
N$19: IC82.2(A:I1) IC82.4(B:I0) IC87.3(A:O)
N$20: IC39.9(C:I1) IC94.6(B:O)
N$21: IC48.8(C:O) IC48.13(D:I1) IC99.12(D:I0)
N$22: IC86.13(F:I) IC88.3(A:O) IC108.5(B:I1)
N$23: IC22.5(Y) IC35.7(3D)
N$24: IC6.11(D:O) IC9.14(4A)
N$25: IC82.10(C:I1) IC82.12(D:I0) IC87.6(B:O)
N$26: IC87.8(C:O) IC90.1(A:I0) IC90.4(B:I0)
N$27: IC6.8(C:O) IC9.11(3A)
N$28: IC87.11(D:O) IC90.9(C:I0) IC90.12(D:I0)
N$29: IC82.1(A:I0) IC82.9(C:I0) IC86.6(C:O) IC90.2(A:I1) IC90.10(C:I1)
N$30: IC8.11(D:O) IC11.11(3A)
N$31: IC68.11(D:O) JP2.22
N$33: IC17.13(BO) IC61.4(DN)
N$34: IC71.13(D:I1) IC83.11(D:O)
N$35: IC77.1(A:I0) IC77.4(B:I0) IC82.3(A:O)
N$36: IC77.9(C:I0) IC77.12(D:I0) IC82.6(B:O)
N$37: IC82.8(C:O) IC83.1(A:I0) IC83.4(B:I0)
N$38: IC82.11(D:O) IC83.9(C:I0) IC83.12(D:I0)
N$39: IC90.3(A:O) IC91.1(A:I0) IC91.4(B:I0)
N$40: IC90.6(B:O) IC91.9(C:I0) IC91.12(D:I0)
N$41: IC90.8(C:O) IC95.1(A:I0) IC95.4(B:I0)
N$42: IC90.11(D:O) IC95.9(C:I0) IC95.13(D:I1)
N$43: IC77.5(B:I1) IC77.13(D:I1) IC83.5(B:I1) IC83.13(D:I1) IC86.8(D:O) IC91.5(B:I1) IC91.13(D:I1) IC95.5(B:I1) IC95.12(D:I0)
N$44: IC36.1(OC) IC112.3(A:O)
N$45: IC92.11(D:O) IC96.10(C:I1)
N$46: IC31.5(Y) IC35.8(4D)
N$48: IC25.6(B:O) IC71.4(B:I0)
N$49: IC70.6(B:O) IC70.10(C:I1)
N$50: IC70.3(A:O) IC70.9(C:I0)
N$51: IC25.3(A:O) IC71.5(B:I1)
N$52: IC129.6(C:O) IC131.11(B:CLK)
N$53: IC20.2(A:I1) IC20.5(B:I1) IC20.10(C:I1) IC20.13(D:I1) IC96.6(B:O)
N$54: IC8.8(C:O) IC11.2(1A)
N$55: IC70.11(D:O) IC108.2(A:I1)
N$56: IC54.2(A:D) IC55.11(D:O)
N$57: IC29.6(B:I1) IC30.6(B:O)
N$58: IC101.7(3D) JP5.6
N$59: IC101.4(2D) JP5.4
N$60: IC101.3(1D) JP5.2
N$61: IC101.17(7D) JP5.14
N$62: IC101.14(6D) JP5.12
N$63: IC101.13(5D) JP5.10
N$64: IC29.9(C:I1) IC30.8(C:O)
N$65: IC35.13(5D) IC37.5(Y)
N$66: IC101.8(4D) JP5.8
N$67: IC67.6(C:O) IC68.12(D:I0)
N$68: IC8.3(A:O) IC8.9(C:I0)
N$69: IC6.6(B:O) IC9.5(2A)
N$70: IC68.8(C:O) JP1.22
N$71: IC29.12(D:I1) IC30.11(D:O)
N$72: IC6.3(A:O) IC9.2(1A)
N$73: IC8.6(B:O) IC11.5(2A)
N$74: IC67.8(D:O) IC131.3(A:CLK)
N$75: IC35.14(6D) IC42.5(Y)
N$76: IC35.17(7D) IC46.5(Y)
N$77: IC75.12(CO) IC80.5(UP)
N$78: IC35.18(8D) IC50.5(Y)
N$79: IC17.12(CO) IC61.5(UP)
N$80: IC48.3(A:O) IC48.12(D:I0)
N$82: IC71.8(C:O) IC108.4(B:I0) IC108.12(D:I0)
N$85: IC112.4(B:I0) IC131.9(B:Q)
N$87: IC57.4(DN) IC129.8(D:O)
N$88: IC112.2(A:I1) IC131.8(B:!Q)
N$89: IC67.10(E:O) IC101.1(OC)
N$93: IC61.13(BO) IC69.4(DN)
N$94: IC61.12(CO) IC69.5(UP)
N$97: IC88.10(C:I1) IC91.6(B:O) IC92.2(A:I1)
N$102: IC8.12(D:I0) IC9.12(4Y)
N$103: IC8.4(B:I0) IC9.7(2Y)
N$104: IC8.2(A:I1) IC8.5(B:I1) IC9.9(3Y)
N$105: IC69.13(BO) IC74.4(DN)
N$106: IC69.12(CO) IC74.5(UP)
N$107: IC8.1(A:I0) IC9.4(1Y)
N$109: IC19.13(D:O) IC63.2(A:I1)
N$111: IC78.5(B:I1) IC83.8(C:O)
N$113: IC70.12(D:I0) IC83.3(A:O)
N$117: IC78.2(A:I1) IC83.6(B:O)
N$118: IC71.12(D:I0) IC78.6(B:O)
N$119: IC103.2(1Q) JP5.1
N$120: IC103.5(2Q) JP5.3
N$136: IC2.5(B:I1) IC2.13(D:I1) IC10.5(B:I1) IC10.13(D:I1) IC20.3(A:O)
N$141: IC25.8(C:O) IC60.5(UP)
N$142: IC25.9(C:I0) IC58.12(CO)
N$148: IC49.11(D:O) JP5.28
N$149: IC86.12(F:O) IC108.13(D:I1)
N$163: IC44.3(A:I1) IC56.11(D:O)
N$170: IC103.6(3Q) JP5.5
N$171: IC12.6(2B) IC65.6(B:O)
N$172: IC103.9(4Q) JP5.7
N$175: IC103.12(5Q) JP5.9
N$178: IC103.15(6Q) JP5.11
N$181: IC103.16(7Q) JP5.13
N$184: IC103.19(8Q) JP5.15
N$185: IC94.5(B:I1) IC94.11(D:O)
N$187: IC94.4(B:I0) IC94.8(C:O)
N$190: IC94.2(A:I1) IC96.11(D:O)
N$192: IC94.1(A:I0) IC96.3(A:O)
N$193: IC39.8(C:I0) IC94.3(A:O)
N$194: IC52.2(A:I1) IC59.6(B:O) IC78.10(C:I1) IC92.5(B:I1) IC126.13(D:I1)
N$197: IC71.9(C:I0) IC71.11(D:O)
N$198: IC71.10(C:I1) IC78.11(D:O)
N$199: IC78.13(D:I1) IC91.3(A:O)
N$202: IC49.8(C:O) JP5.30
N$203: IC92.13(D:I1) IC129.10(E:O)
N$208: IC97.12(CO) IC102.5(UP)
N$209: IC93.12(CO) IC97.5(UP)
N$210: IC93.13(BO) IC97.4(DN)
N$211: IC97.13(BO) IC102.4(DN)
N$212: IC7.1(A:I0) IC7.12(D:I0) IC14.12(F:O)
N$214: IC7.2(A:I1) IC7.5(B:I1) IC14.2(A:O)
N$215: IC102.13(BO) IC106.4(DN)
N$216: IC102.12(CO) IC106.5(UP)
N$219: IC92.8(C:O) IC99.2(A:I1) IC100.2(A:I1) IC126.2(A:I1) IC126.10(C:I1)
N$221: IC14.4(B:O) IC28.1(A:I0) IC28.12(D:I0)
N$228: IC101.18(8D) JP5.16
N$235: IC20.11(D:O) IC24.5(B:I1) IC24.13(D:I1)
N$236: IC67.2(A:O) JP2.8
N$237: IC19.10(C:O) JP2.6
N$239: IC20.8(C:O) IC24.2(A:I1) IC24.10(C:I1)
N$241: IC57.12(CO) IC58.5(UP)
N$244: IC60.13(BO) IC64.4(DN)
N$245: IC60.12(CO) IC64.5(UP)
N$248: IC65.3(A:O) IC65.9(C:I0)
N$258: IC4.5(Y) IC36.3(1D)
N$259: IC16.5(Y) IC36.4(2D)
N$260: IC23.5(Y) IC36.7(3D)
N$261: IC32.5(Y) IC36.8(4D)
N$262: IC36.13(5D) IC38.5(Y)
N$263: IC36.14(6D) IC43.5(Y)
N$264: IC36.17(7D) IC47.5(Y)
N$265: IC36.18(8D) IC51.5(Y)
OPC==E: IC19.12(D:I1) IC63.11(D:O) IC92.10(C:I1)
OPC==F: IC19.11(D:I0) IC59.4(B:I0) IC63.6(B:O)
OPC_67_OUPUT0/REG0_JMP: IC6.2(A:I1) IC7.3(A:O) IC20.1(A:I0) IC88.2(A:I1)
OPC_67_OUPUT1: IC6.5(B:I1) IC7.6(B:O) IC20.4(B:I0)
OPC_67_OUPUT2==11: IC6.10(C:I1) IC7.8(C:O) IC20.9(C:I0) IC63.5(B:I1)
OPC_67_OUPUT3==10: IC6.13(D:I1) IC7.11(D:O) IC20.12(D:I0) IC63.13(D:I1)
OPCODE_0: IC45.2(1Q) IC86.1(A:I) IC87.4(B:I0) IC87.9(C:I0)
OPCODE_1: IC45.5(2Q) IC86.3(B:I) IC87.10(C:I1) IC87.13(D:I1)
OPCODE_2: IC45.6(3Q) IC82.5(B:I1) IC82.13(D:I1) IC86.5(C:I) IC90.5(B:I1) IC90.13(D:I1)
OPCODE_3: IC45.9(4Q) IC77.2(A:I1) IC77.10(C:I1) IC83.2(A:I1) IC83.10(C:I1) IC86.9(D:I) IC91.2(A:I1) IC91.10(C:I1) IC95.2(A:I1) IC95.10(C:I1)
OPCODE_4: IC11.3(1B) IC14.3(B:I) IC25.4(B:I0) IC28.4(B:I0) IC28.9(C:I0) IC45.12(5Q)
OPCODE_5: IC11.6(2B) IC14.5(C:I) IC25.1(A:I0) IC28.10(C:I1) IC28.13(D:I1) IC45.15(6Q)
OPCODE_6: IC7.4(B:I0) IC7.9(C:I0) IC11.10(3B) IC14.13(F:I) IC25.5(B:I1) IC45.16(7Q)
OPCODE_7: IC7.10(C:I1) IC7.13(D:I1) IC11.13(4B) IC14.1(A:I) IC25.2(A:I1) IC45.19(8Q)
OPCODE_LOAD_INPUT/!CYCL_1: IC45.11(CLK) IC53.6(A:!Q)
OPERAND_REGB_OUTPUT: IC1.6(B:O) IC9.1(!A!/B) IC19.2(A:I0)
PC_COUNT_UP: IC39.13(D:O) IC57.5(UP)
PC_COUNT_UP_RET: IC48.4(B:I0) IC126.8(C:O)
PC_COUNT_UP_SAVE_LR: IC48.5(B:I1) IC52.3(A:O)
PC_DATA_OUT_0: IC4.2(D2) IC13.3(1B) IC57.3(QA)
PC_DATA_OUT_1: IC13.6(2B) IC16.2(D2) IC57.2(QB)
PC_DATA_OUT_2: IC13.10(3B) IC23.2(D2) IC57.6(QC)
PC_DATA_OUT_3: IC13.13(4B) IC32.2(D2) IC57.7(QD)
PC_DATA_OUT_4: IC21.3(1B) IC38.2(D2) IC58.3(QA)
PC_DATA_OUT_5: IC21.6(2B) IC43.2(D2) IC58.2(QB)
PC_DATA_OUT_6: IC21.10(3B) IC47.2(D2) IC58.6(QC)
PC_DATA_OUT_7: IC21.13(4B) IC51.2(D2) IC58.7(QD)
PC_DATA_OUT_8: IC4.1(D3) IC27.3(1B) IC60.3(QA)
PC_DATA_OUT_9: IC16.1(D3) IC27.6(2B) IC60.2(QB)
PC_DATA_OUT_10: IC23.1(D3) IC27.10(3B) IC60.6(QC)
PC_DATA_OUT_11: IC27.13(4B) IC32.1(D3) IC60.7(QD)
PC_DATA_OUT_12: IC34.3(1B) IC38.1(D3) IC64.3(QA)
PC_DATA_OUT_13: IC34.6(2B) IC43.1(D3) IC64.2(QB)
PC_DATA_OUT_14: IC34.10(3B) IC47.1(D3) IC64.6(QC)
PC_DATA_OUT_15: IC34.13(4B) IC51.1(D3) IC64.7(QD)
PC_H_COUNT_DOWN_JMP_O: IC60.4(DN) IC88.6(B:O)
PC_H_COUNT_UP_JMP_O: IC25.10(C:I1) IC88.11(D:O)
PC_H_LOAD_INPUT_TABLE_1: IC24.11(D:O) IC44.5(B:I0)
PC_HIGH_LOAD_INPUT_JMP: IC52.8(C:O) IC56.5(B:I1)
PC_HIGH_LOAD_INPUT_NOT: IC44.4(B:O) IC60.11(LD) IC64.11(LD)
PC_L_LOAD_INPUT_TABLE_1: IC24.8(C:O) IC56.13(D:I1)
PC_L_TO_DBUS: IC56.3(A:O) IC65.5(B:I1) IC65.12(D:I0)
PC_LOW_LOAD_INPUT_JMP: IC52.6(B:O) IC56.9(C:I0)
PC_LOW_LOAD_INPUT_NOT: IC44.1(A:O) IC57.11(LD) IC58.11(LD)
POP/SAVE_LR/RET: IC48.2(A:I1) IC59.5(B:I1) IC63.1(A:I0) IC92.9(C:I0) IC95.11(D:O)
PTR_COUNT_UP: IC17.5(UP) IC129.12(F:O)
PTR_COUNT_UP_LDR_I: IC55.1(A:I0) IC89.3(A:O)
PTR_COUNT_UP_STR_I: IC55.2(A:I1) IC99.6(B:O)
PTR_DATA_OUT_0: IC3.14(D5) IC13.2(1A) IC17.3(QA)
PTR_DATA_OUT_1: IC13.5(2A) IC15.14(D5) IC17.2(QB)
PTR_DATA_OUT_2: IC13.11(3A) IC17.6(QC) IC22.14(D5)
PTR_DATA_OUT_3: IC13.14(4A) IC17.7(QD) IC31.14(D5)
PTR_DATA_OUT_4: IC21.2(1A) IC37.14(D5) IC61.3(QA)
PTR_DATA_OUT_5: IC21.5(2A) IC42.14(D5) IC61.2(QB)
PTR_DATA_OUT_6: IC21.11(3A) IC46.14(D5) IC61.6(QC)
PTR_DATA_OUT_7: IC21.14(4A) IC50.14(D5) IC61.7(QD)
PTR_DATA_OUT_8: IC3.13(D6) IC27.2(1A) IC69.3(QA)
PTR_DATA_OUT_9: IC15.13(D6) IC27.5(2A) IC69.2(QB)
PTR_DATA_OUT_10: IC22.13(D6) IC27.11(3A) IC69.6(QC)
PTR_DATA_OUT_11: IC27.14(4A) IC31.13(D6) IC69.7(QD)
PTR_DATA_OUT_12: IC34.2(1A) IC37.13(D6) IC74.3(QA)
PTR_DATA_OUT_13: IC34.5(2A) IC42.13(D6) IC74.2(QB)
PTR_DATA_OUT_14: IC34.11(3A) IC46.13(D6) IC74.6(QC)
PTR_DATA_OUT_15: IC34.14(4A) IC50.13(D6) IC74.7(QD)
PTR_H_LOAD_INPUT_NOT: IC39.4(B:O) IC69.11(LD) IC74.11(LD)
PTR_L_LOAD_INPUT_NOT: IC17.11(LD) IC39.1(A:O) IC61.11(LD)
PTR_TO_ABUS: IC13.1(!A!/B) IC19.5(B:I0) IC21.1(!A!/B) IC27.1(!A!/B) IC34.1(!A!/B) IC68.3(A:O)
PUSH: IC48.10(C:I1) IC95.8(C:O) IC126.5(B:I1) IC130.5(B:I1)
REG0_ZERO: IC39.10(C:O) IC78.1(A:I0) IC78.4(B:I0) JP4.20
REG_0_LOAD_INPUT: IC29.1(A:O) IC33.11(CLK)
REG_0_OUT_0: IC3.3(D1) IC33.2(1Q) IC96.1(A:I0) JP4.23
REG_0_OUT_1: IC15.3(D1) IC33.5(2Q) IC96.2(A:I1) JP4.25
REG_0_OUT_2: IC22.3(D1) IC33.6(3Q) IC96.12(D:I0) JP4.27
REG_0_OUT_3: IC31.3(D1) IC33.9(4Q) IC96.13(D:I1) JP4.29
REG_0_OUT_4: IC33.12(5Q) IC37.3(D1) IC94.9(C:I0) JP4.31
REG_0_OUT_5: IC33.15(6Q) IC42.3(D1) IC94.10(C:I1) JP4.33
REG_0_OUT_6: IC33.16(7Q) IC46.3(D1) IC94.12(D:I0) JP4.35
REG_0_OUT_7: IC33.19(8Q) IC50.3(D1) IC94.13(D:I1) JP4.37
REG_1_LOAD_INPUT: IC26.11(CLK) IC29.4(B:O)
REG_1_OUT_0: IC3.2(D2) IC26.2(1Q)
REG_1_OUT_1: IC15.2(D2) IC26.5(2Q)
REG_1_OUT_2: IC22.2(D2) IC26.6(3Q)
REG_1_OUT_3: IC26.9(4Q) IC31.2(D2)
REG_1_OUT_4: IC26.12(5Q) IC37.2(D2)
REG_1_OUT_5: IC26.15(6Q) IC42.2(D2)
REG_1_OUT_6: IC26.16(7Q) IC46.2(D2)
REG_1_OUT_7: IC26.19(8Q) IC50.2(D2)
REG_2_LOAD_INPUT: IC18.11(CLK) IC29.10(C:O)
REG_2_OUT_0: IC3.1(D3) IC18.2(1Q)
REG_2_OUT_1: IC15.1(D3) IC18.5(2Q)
REG_2_OUT_2: IC18.6(3Q) IC22.1(D3)
REG_2_OUT_3: IC18.9(4Q) IC31.1(D3)
REG_2_OUT_4: IC18.12(5Q) IC37.1(D3)
REG_2_OUT_5: IC18.15(6Q) IC42.1(D3)
REG_2_OUT_6: IC18.16(7Q) IC46.1(D3)
REG_2_OUT_7: IC18.19(8Q) IC50.1(D3)
REG_3_LOAD_INPUT: IC5.11(CLK) IC29.13(D:O)
REG_3_OUT_0: IC3.15(D4) IC5.2(1Q)
REG_3_OUT_1: IC5.5(2Q) IC15.15(D4)
REG_3_OUT_2: IC5.6(3Q) IC22.15(D4)
REG_3_OUT_3: IC5.9(4Q) IC31.15(D4)
REG_3_OUT_4: IC5.12(5Q) IC37.15(D4)
REG_3_OUT_5: IC5.15(6Q) IC42.15(D4)
REG_3_OUT_6: IC5.16(7Q) IC46.15(D4)
REG_3_OUT_7: IC5.19(8Q) IC50.15(D4)
REG_TO_DBUS_H_JMP_RET: IC44.6(B:I1) IC56.6(B:O)
REG_TO_DBUS_L_JMP_RET: IC44.2(A:I0) IC56.8(C:O)
REGISTER_OUTPUT_SEL_0: IC3.11(A) IC4.11(A) IC12.4(1Y) IC15.11(A) IC16.11(A) IC22.11(A) IC23.11(A) IC31.11(A) IC32.11(A) IC37.11(A) IC38.11(A) IC42.11(A) IC43.11(A) IC46.11(A) IC47.11(A) IC50.11(A) IC51.11(A)
REGISTER_OUTPUT_SEL_0_: IC11.4(1Y) IC12.2(1A)
REGISTER_OUTPUT_SEL_1: IC3.10(B) IC4.10(B) IC12.7(2Y) IC15.10(B) IC16.10(B) IC22.10(B) IC23.10(B) IC31.10(B) IC32.10(B) IC37.10(B) IC38.10(B) IC42.10(B) IC43.10(B) IC46.10(B) IC47.10(B) IC50.10(B) IC51.10(B)
REGISTER_OUTPUT_SEL_1_: IC11.7(2Y) IC12.5(2A)
REGISTER_OUTPUT_SEL_2: IC3.9(C) IC4.9(C) IC12.9(3Y) IC15.9(C) IC16.9(C) IC22.9(C) IC23.9(C) IC31.9(C) IC32.9(C) IC37.9(C) IC38.9(C) IC42.9(C) IC43.9(C) IC46.9(C) IC47.9(C) IC50.9(C) IC51.9(C)
REGISTER_OUTPUT_SEL_2_: IC11.9(3Y) IC12.11(3A)
REGISTER_OUTPUT_SEL_3: IC12.12(4Y) IC59.12(D:I0) IC129.3(B:I) IC131.12(B:D)
REGISTER_OUTPUT_SEL_3_: IC11.12(4Y) IC12.14(4A)
REGS_OUTPUT_TO_DATABUS_ENABLE: IC35.1(OC) IC112.6(B:O)
RING_CNTR_CLOCK: IC53.3(A:CLK) IC53.11(B:CLK) IC54.3(A:CLK) IC54.11(B:CLK) IC59.2(A:I1) IC59.13(D:I1) IC105.3(A:CLK) IC105.11(B:CLK) IC129.5(C:I) JP4.4
SECOND_LATCH_SELECT: IC12.1(!A!/B) IC12.13(4B) IC65.8(C:O)
SELECT_CARRY_BIT: IC70.8(C:O) IC72.2(A:I1) IC72.10(C:I1) IC72.13(D:I1) IC89.5(B:I1)
SP_COUNT_DOWN: IC93.4(DN) IC130.11(D:O)
SP_COUNT_UP/WRITE_REG_TO_DBUS_SELECTOR2_PUSH: IC55.10(C:I1) IC93.5(UP) IC130.6(B:O)
SP_DATA_OUT_0: IC93.3(QA) JP2.1
SP_DATA_OUT_1: IC93.2(QB) JP2.3
SP_DATA_OUT_2: IC93.6(QC) JP2.5
SP_DATA_OUT_3: IC93.7(QD) JP2.7
SP_DATA_OUT_4: IC97.3(QA) JP2.9
SP_DATA_OUT_5: IC97.2(QB) JP2.11
SP_DATA_OUT_6: IC97.6(QC) JP2.13
SP_DATA_OUT_7: IC97.7(QD) JP2.15
SP_DATA_OUT_8: IC102.3(QA) JP2.17
SP_DATA_OUT_9: IC102.2(QB) JP2.19
SP_DATA_OUT_10: IC102.6(QC) JP2.21
SP_DATA_OUT_11: IC102.7(QD) JP2.23
SP_DATA_OUT_12: IC106.3(QA) JP2.25
SP_DATA_OUT_13: IC106.2(QB) JP2.27
SP_DATA_OUT_14: IC106.6(QC) JP2.29
SP_DATA_OVER/UNDERFLOW: IC106.7(QD) JP4.18
STATE_0/CYCL_3: IC40.9(C:I0) IC52.1(A:I0) IC54.5(A:Q) IC54.12(B:D) IC99.1(A:I0) IC100.4(B:I0) IC100.9(C:I0) IC100.12(D:I0) IC130.4(B:I0) JP4.30
STATE_1/CYCL_4: IC40.4(B:I0) IC52.4(B:I0) IC54.9(B:Q) IC72.1(A:I0) IC78.9(C:I0) IC89.1(A:I0) IC92.1(A:I0) IC100.1(A:I0) IC105.2(A:D) IC108.1(A:I0) IC126.4(B:I0) IC130.9(C:I0) IC130.12(D:I0) JP4.32
STATE_2/CYCL_5: IC40.12(D:I0) IC52.12(D:I0) IC72.9(C:I0) IC88.9(C:I0) IC92.4(B:I0) IC99.4(B:I0) IC105.5(A:Q) IC105.12(B:D) IC126.1(A:I0) JP4.34
STATE_3/CYCL_6: IC40.1(A:I0) IC52.9(C:I0) IC53.2(A:D) IC72.12(D:I0) IC105.9(B:Q) IC126.9(C:I0) IC126.12(D:I0) JP4.36
STORE_ALU_OUTPUT: IC49.6(B:O) IC101.11(ENC)
STORE_ALU_OUTPUT/STORE_CARRY_ALU: IC49.4(B:I0) IC67.9(D:I) IC72.8(C:O)
STORE_ALU_OUTPUT_JMP_O: IC40.11(D:O) IC49.5(B:I1) IC88.5(B:I1) IC88.13(D:I1)
STR: IC71.2(A:I1) IC95.6(B:O)
STR/STR_I: IC48.9(C:I0) IC71.3(A:O) IC100.13(D:I1) IC130.10(C:I1)
STR_I: IC71.1(A:I0) IC95.3(A:O) IC99.5(B:I1)
TABLE_1_INPUT_PTR_HIGH: IC10.6(B:O) IC39.5(B:I0)
TABLE_1_INPUT_PTR_L: IC10.3(A:O) IC39.2(A:I0)
TABLE_1_INPUT_REG0: IC2.3(A:O) IC29.2(A:I0)
TABLE_1_INPUT_REG1: IC2.6(B:O) IC29.5(B:I0)
TABLE_1_INPUT_REG2: IC2.8(C:O) IC29.8(C:I0)
TABLE_1_INPUT_REG3: IC2.11(D:O) IC29.11(D:I0)
TIMER_CLOCK: IC75.5(UP) JP4.3
TIMER_REG_0: IC4.12(D7) IC75.3(QA)
TIMER_REG_1: IC16.12(D7) IC75.2(QB)
TIMER_REG_2: IC23.12(D7) IC75.6(QC)
TIMER_REG_3: IC32.12(D7) IC75.7(QD)
TIMER_REG_4: IC38.12(D7) IC80.3(QA)
TIMER_REG_5: IC43.12(D7) IC80.2(QB)
TIMER_REG_6: IC47.12(D7) IC80.6(QC)
TIMER_REG_7: IC51.12(D7) IC80.7(QD)
TWO_BYTE_CMD: IC14.10(E:O) IC89.13(D:I1)
VCC: IC17.4(DN) IC53.1(A:CLR) IC53.10(B:PRE) IC54.4(A:PRE) IC54.10(B:PRE) IC58.4(DN) IC75.4(DN) IC75.11(LD) IC80.4(DN) IC80.11(LD) IC93.11(LD) IC97.11(LD) IC102.11(LD) IC105.4(A:PRE) IC105.10(B:PRE) IC106.11(LD) IC131.10(B:PRE) IC131.13(B:CLR) JP1.28 JP2.12 JP2.28 JP3.19 JP3.20 JP4.17 JP4.19 JP5.19 JP5.20
WQWJKDHSAAASDFXGHCJFDSAAS: IC40.2(A:I1) IC40.5(B:I1) IC40.10(C:I1) IC40.13(D:I1) IC59.9(C:I0) IC108.6(B:O) IC108.9(C:I0)
WRITE_LR_L_DBUS_RET: IC65.1(A:I0) IC99.3(A:O)
WRITE_PC_H/WRITE_PC_L_DBUS_SAVE_LR: IC12.10(3B) IC65.10(C:I1) IC65.11(D:O)
WRITE_PC_L_DBUS_JMP_O: IC40.8(C:O) IC56.2(A:I1)
WRITE_PC_L_DBUS_SAVE_LR: IC56.1(A:I0) IC78.8(C:O)
WRITE_PTR_TO_ABUS/CLR_NOT_OE/CLR_NOT_CS/FILL_REGISTER_LDR: IC68.1(A:I0) IC68.5(B:I1) IC96.5(B:I1) IC100.8(C:O)
WRITE_PTR_TO_ABUS/CLR_NOT_WE/CLR_NOT_CS_STR: IC67.3(B:I) IC68.2(A:I1) IC130.8(C:O)
WRITE_REG_TO_DBUS_SELECTOR2_STR: IC55.9(C:I0) IC100.11(D:O)
WRITE_REGB_TO_DBUS_JMP: IC1.12(D:I0) IC52.11(D:O)
Unconnected: IC3.6(W) IC4.6(W) IC14.8(D:O) IC14.9(D:I) IC15.6(W) IC16.6(W) IC22.6(W) IC23.6(W) IC25.11(D:O) IC25.12(D:I0) IC25.13(D:I1) IC31.6(W) IC32.6(W) IC37.6(W) IC38.6(W) IC42.6(W) IC43.6(W) IC46.6(W) IC47.6(W) IC50.6(W) IC51.6(W) IC54.6(A:!Q) IC54.8(B:!Q) IC57.13(BO) IC58.13(BO) IC63.8(C:O) IC63.9(C:I0) IC63.10(C:I1) IC64.12(CO) IC64.13(BO) IC74.12(CO) IC74.13(BO) IC75.13(BO) IC80.12(CO) IC80.13(BO) IC105.6(A:!Q) IC105.8(B:!Q) IC106.12(CO) IC106.13(BO) IC129.1(A:I) IC129.2(A:O) IC130.1(A:I0) IC130.2(A:I1) IC130.3(A:O) IC131.6(A:!Q) JP2.16

## Buses
DATA_BUS:DATA[0..7]
ADRR_BUS:ADRR_[0..15]

## Notes on the sheet
- Opcode Operand Decoder | Registers
- Decode Table 0/2
- DBus Mux
- Multiplexer to use either Output_REGX or INPUT_REGX for the output selecter
- Decode Table 1
- Reg3
- ABus Mux
- Encode it for the reg_selector
- Switch between decode table 1 and 2
- Reg2
- Check if output_reg == input_reg if yes, IR needs to be applied to dbus
- Reg1
- Reg0
- Latch | Latch
- InstructionRegister_HIGH
- Operand byte storage for two-byte instructions
- OpcodeStorage
- Ring Counter
- Table 0
- ProgrammCounter
- Table 2
- count down because SAVE_LR counts up in Cycle1 and down in Cycle5
- CYCL_1
- CYCL_2 | CYCL_3 | CYCL_4 | CYCL_5 | CYCL_6
- When ALU or Memory write to DBUS --> Dont output reg to dbus
- Memory Interface
- FLASH W29EE011
- only change latch on falling edge
- Write reg to dbus every cycle
- PTR - Pointer Register
- Addr15 decides whether to use RAM or FLASH
- StackMemory | RAM W24129AK
- Opcode Instruction Decoder
- I/O Registers
- ALU_OPERATION
- Output Registers
- Timer | Output_reg1 | Input Register
- ALU
- SP
- MOV
- MOVZ
- LR low | Output_reg2
- JMPZ
- JMP
- JMP
- LR high
- JMPC | JMP (with offset)
- Opcode Nibble | Check whether offset jmp
- SET_PTR
- Misc
- SP
- LDR_I
- ALU Interface
- Check whether reg0 is zero. Needed for the MOVZ and JMPZ instruction
- SP never needs to load input. It just gets reseted on startup
- LDR
- From ALU Output
- STR_I | To ALU input B
- Latch
- To ALU input A | ALU Function Selection
- STR
- PUSH
- POP
- SAVE_LR
- RET

## Power pins joined to a net without a drawn wire
GND: IC1.7(P:GND) IC2.7(P:GND) IC3.8(GND) IC4.8(GND) IC5.10(GND) IC6.7(P:GND) IC7.7(P:GND) IC8.7(P:GND) IC9.8(GND) IC10.7(P:GND) IC11.8(GND) IC12.8(GND) IC13.8(GND) IC14.7(P:GND) IC15.8(GND) IC16.8(GND) IC17.8(GND) IC18.10(GND) IC19.7(P:GND) IC20.7(P:GND) IC21.8(GND) IC22.8(GND) IC23.8(GND) IC24.7(P:GND) IC25.7(P:GND) IC26.10(GND) IC27.8(GND) IC28.7(P:GND) IC29.7(P:GND) IC30.7(P:GND) IC31.8(GND) IC32.8(GND) IC33.10(GND) IC34.8(GND) IC35.10(GND) IC36.10(GND) IC37.8(GND) IC38.8(GND) IC39.7(P:GND) IC40.7(P:GND) IC41.10(GND) IC42.8(GND) IC43.8(GND) IC44.7(P:GND) IC45.10(GND) IC46.8(GND) IC47.8(GND) IC48.7(P:GND) IC49.7(P:GND) IC50.8(GND) IC51.8(GND) IC52.7(P:GND) IC53.7(P:GND) IC54.7(P:GND) IC55.7(P:GND) IC56.7(P:GND) IC57.8(GND) IC58.8(GND) IC59.7(P:GND) IC60.8(GND) IC61.8(GND) IC63.7(P:GND) IC64.8(GND) IC65.7(P:GND) IC67.7(P:GND) IC68.7(P:GND) IC69.8(GND) IC70.7(P:GND) IC71.7(P:GND) IC72.7(P:GND) IC73.10(GND) IC74.8(GND) IC75.8(GND) IC77.7(P:GND) IC78.7(P:GND) IC79.10(GND) IC80.8(GND) IC81.10(GND) IC82.7(P:GND) IC83.7(P:GND) IC85.10(GND) IC86.7(P:GND) IC87.7(P:GND) IC88.7(P:GND) IC89.7(P:GND) IC90.7(P:GND) IC91.7(P:GND) IC92.7(P:GND) IC93.8(GND) IC94.7(P:GND) IC95.7(P:GND) IC96.7(P:GND) IC97.8(GND) IC99.7(P:GND) IC100.7(P:GND) IC101.10(GND) IC102.8(GND) IC103.10(GND) IC105.7(P:GND) IC106.8(GND) IC108.7(P:GND) IC112.7(P:GND) IC126.7(P:GND) IC129.7(P:GND) IC130.7(P:GND) IC131.7(P:GND)
VCC: IC1.14(P:VCC) IC2.14(P:VCC) IC3.16(VCC) IC4.16(VCC) IC5.20(VCC) IC6.14(P:VCC) IC7.14(P:VCC) IC8.14(P:VCC) IC9.16(VCC) IC10.14(P:VCC) IC11.16(VCC) IC12.16(VCC) IC13.16(VCC) IC14.14(P:VCC) IC15.16(VCC) IC16.16(VCC) IC17.16(VCC) IC18.20(VCC) IC19.14(P:VCC) IC20.14(P:VCC) IC21.16(VCC) IC22.16(VCC) IC23.16(VCC) IC24.14(P:VCC) IC25.14(P:VCC) IC26.20(VCC) IC27.16(VCC) IC28.14(P:VCC) IC29.14(P:VCC) IC30.14(P:VCC) IC31.16(VCC) IC32.16(VCC) IC33.20(VCC) IC34.16(VCC) IC35.20(VCC) IC36.20(VCC) IC37.16(VCC) IC38.16(VCC) IC39.14(P:VCC) IC40.14(P:VCC) IC41.20(VCC) IC42.16(VCC) IC43.16(VCC) IC44.14(P:VCC) IC45.20(VCC) IC46.16(VCC) IC47.16(VCC) IC48.14(P:VCC) IC49.14(P:VCC) IC50.16(VCC) IC51.16(VCC) IC52.14(P:VCC) IC53.14(P:VCC) IC54.14(P:VCC) IC55.14(P:VCC) IC56.14(P:VCC) IC57.16(VCC) IC58.16(VCC) IC59.14(P:VCC) IC60.16(VCC) IC61.16(VCC) IC63.14(P:VCC) IC64.16(VCC) IC65.14(P:VCC) IC67.14(P:VCC) IC68.14(P:VCC) IC69.16(VCC) IC70.14(P:VCC) IC71.14(P:VCC) IC72.14(P:VCC) IC73.20(VCC) IC74.16(VCC) IC75.16(VCC) IC77.14(P:VCC) IC78.14(P:VCC) IC79.20(VCC) IC80.16(VCC) IC81.20(VCC) IC82.14(P:VCC) IC83.14(P:VCC) IC85.20(VCC) IC86.14(P:VCC) IC87.14(P:VCC) IC88.14(P:VCC) IC89.14(P:VCC) IC90.14(P:VCC) IC91.14(P:VCC) IC92.14(P:VCC) IC93.16(VCC) IC94.14(P:VCC) IC95.14(P:VCC) IC96.14(P:VCC) IC97.16(VCC) IC99.14(P:VCC) IC100.14(P:VCC) IC101.20(VCC) IC102.16(VCC) IC103.20(VCC) IC105.14(P:VCC) IC106.16(VCC) IC108.14(P:VCC) IC112.14(P:VCC) IC126.14(P:VCC) IC129.14(P:VCC) IC130.14(P:VCC) IC131.14(P:VCC)

## Library data of the parts
IC1 IC8 IC48 IC49 IC55 IC56 IC65 IC68 IC70 IC71 IC94 IC96 IC112 = 74xx-eu:74*32: Quad 2-input OR gate
IC2 IC6 IC7 IC10 IC20 IC24 IC28 IC30 IC40 IC52 IC59 IC63 IC72 IC77 IC78 IC82 IC83 IC87-IC92 IC95 IC99 IC100 IC108 IC126 IC130 = 74xx-eu:74*08: Quad 2-input AND gate
IC3 IC4 IC15 IC16 IC22 IC23 IC31 IC32 IC37 IC38 IC42 IC43 IC46 IC47 IC50 IC51 = 74xx-eu:74*151: Data SELECTOR/MULTIPLEXER
IC5 IC18 IC26 IC33 IC41 IC45 IC73 IC79 IC81 IC85 = 74xx-eu:74*374: Octal D type transparent LATCH, edge triggered
IC9 IC11-IC13 IC21 IC27 IC34 = 74xx-eu:74*157: Quadruple 2-line to 1-line data SELECTOR/MULTIPLEXER
IC14 IC67 IC86 IC129 = 74xx-eu:74*04: Hex INVERTER
IC17 IC57 IC58 IC60 IC61 IC64 IC69 IC74 IC75 IC80 IC93 IC97 IC102 IC106 = custom_parts:74*193: Synchronous 4-bit UP/DOWN COUNTER
IC19 IC29 IC39 IC44 = 74xx-eu:74*02: Quad 2-input NOR gate
IC25 = 74xx-eu:74*86: Quad 2-input EXCLUSIVE-OR (XOR) gate
IC35 IC36 IC101 IC103 = 74xx-eu:74*373: Octal D type transparent LATCH, edge triggered
IC53 IC54 IC105 IC131 = 74xx-eu:74*74: Dual D type positive edge triggered FLIP FLOP, preset and clear
JP1 JP2 = pinhead:PINHD-2X15: PIN HEADER
JP3-JP5 = pinhead:PINHD-2X20: PIN HEADER